# EAGLE design OmniRotor (EAGLE 6.3)
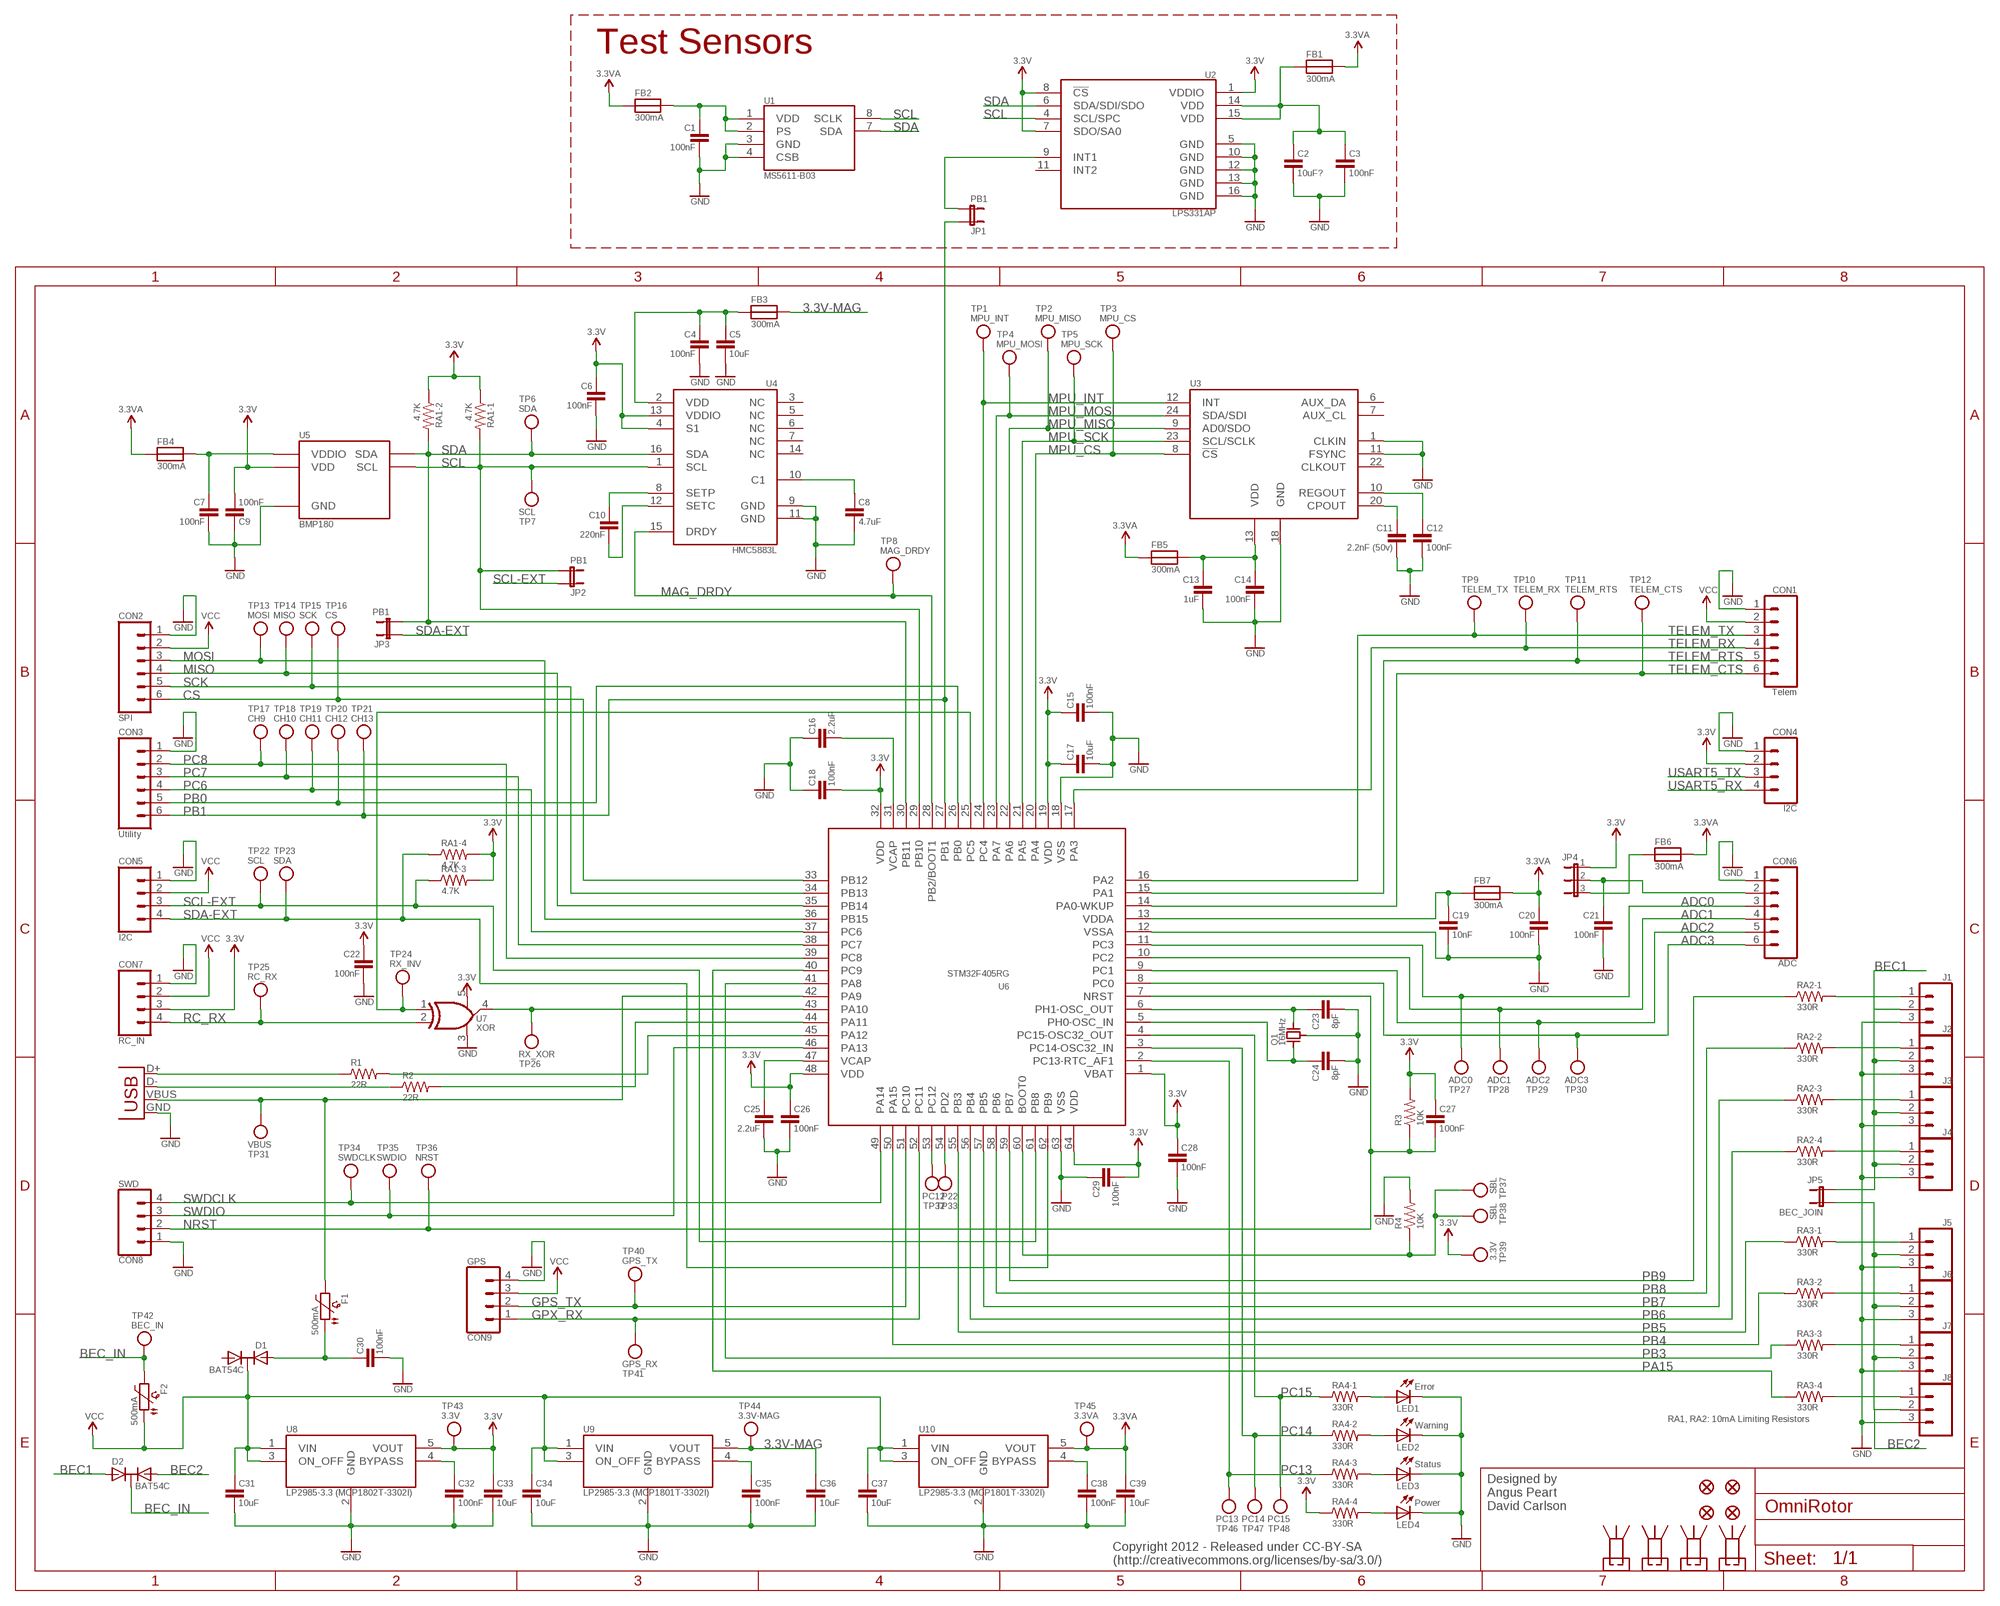
[diagram p0: schematic, sheet 1]

## Parts
C1  100nF  CAPACITOR0402  [0402-CAP@1]
C2  10uF?  CAPACITOR0603  [0603@1]
C3  100nF  CAPACITOR0402  [0402-CAP@1]
C4  100nF  CAPACITOR0402  [0402-CAP@1]
C5  10uF  CAPACITOR0805  [0805@1]
C6  100nF  CAPACITOR0402  [0402-CAP@1]
C7  100nF  CAPACITOR0402  [0402-CAP@1]
C8  4.7uF  CAPACITOR0603  [0603@1]
C9  100nF  CAPACITOR0402  [0402-CAP@1]
C10  220nF  CAPACITOR0402  [0402-CAP@1]
C11  2.2nF (50v)  CAPACITOR0402  [0402-CAP@1]
C12  100nF  CAPACITOR0402  [0402-CAP@1]
C13  1uF  CAPACITOR0603  [0603@1]
C14  100nF  CAPACITOR0402  [0402-CAP@1]
C15  100nF  CAPACITOR0402  [0402-CAP@1]
C16  2.2uF  CAPACITOR0603  [0603@1]
C17  10uF  CAPACITOR-CERAMIC0805  [0805]
C18  100nF  CAPACITOR0402  [0402-CAP@1]
C19  10nF  CAPACITOR0402  [0402-CAP@1]
C20  100nF  CAPACITOR0402  [0402-CAP@1]
C21  100nF  CAPACITOR0402  [0402-CAP@1]
C22  100nF  CAPACITOR0402  [0402-CAP@1]
C23  8pF  CAPACITOR0402  [0402-CAP@1]
C24  8pF  CAPACITOR0402  [0402-CAP@1]
C25  2.2uF  CAPACITOR0603  [0603@1]
C26  100nF  CAPACITOR0402  [0402-CAP@1]
C27  100nF  CAPACITOR0402  [0402-CAP@1]
C28  100nF  CAPACITOR0402  [0402-CAP@1]
C29  100nF  CAPACITOR0402  [0402-CAP@1]
C30  100nF  CAPACITOR0402  [0402-CAP@1]
C31  10uF  CAPACITOR-CERAMIC0805  [0805]
C32  100nF  CAPACITOR0402  [0402-CAP@1]
C33  10uF  CAPACITOR-CERAMIC0805  [0805]
C34  10uF  CAPACITOR-CERAMIC0805  [0805]
C35  100nF  CAPACITOR0402  [0402-CAP@1]
C36  10uF  CAPACITOR-CERAMIC0805  [0805]
C37  10uF  CAPACITOR-CERAMIC0805  [0805]
C38  100nF  CAPACITOR0402  [0402-CAP@1]
C39  10uF  CAPACITOR-CERAMIC0805  [0805]
CON1  Telem  M06JST-SH-SIDE  [SM06B-SRSS-TB]
CON2  SPI  M06JST-SH-SIDE  [SM06B-SRSS-TB]
CON3  Utility  M06JST-SH-SIDE  [SM06B-SRSS-TB]
CON4  I2C  M04JST-SH-SIDE  [SM04B-SRSS-TB]
CON5  I2C  M04JST-SH-SIDE  [SM04B-SRSS-TB]
CON6  ADC  M06JST-SH-SIDE  [SM06B-SRSS-TB]
CON7  RC_IN  M04JST-SH-SIDE  [SM04B-SRSS-TB]
CON8  SWD  M04JST-SH-TOP  [BM04B-SRSS-TB]
CON9  GPS  M04JST-SH-SIDE  [SM04B-SRSS-TB]
D1  BAT54C  [SOT23]
D2  BAT54C  [SOT23]
F1  500mA  PTC1210  [1210-PTC]
F2  500mA  PTC1210  [1210-PTC]
FB1  300mA  FERRITE0603  [0603]
FB2  300mA  FERRITE0603  [0603]
FB3  300mA  FERRITE0603  [0603]
FB4  300mA  FERRITE0603  [0603]
FB5  300mA  FERRITE0603  [0603]
FB6  300mA  FERRITE0603  [0603]
FB7  300mA  FERRITE0603  [0603]
FID1  FIDUCIAL1X2.5  [FIDUCIAL-1X2.5]
FID2  FIDUCIAL1X2.5  [FIDUCIAL-1X2.5]
FID3  FIDUCIAL1X2.5  [FIDUCIAL-1X2.5]
FID4  FIDUCIAL1X2.5  [FIDUCIAL-1X2.5]
J1  M03PTH  [1X03]
J2  M03PTH  [1X03]
J3  M03PTH  [1X03]
J4  M03PTH  [1X03]
J5  M03PTH  [1X03]
J6  M03PTH  [1X03]
J7  M03PTH  [1X03]
J8  M03PTH  [1X03]
JP1  PB1  JUMPER-2NO  [SJ_2_NO]
JP2  PB1  JUMPER-2NO  [SJ_2_NO]
JP3  PB1  JUMPER-2NO  [SJ_2_NO]
JP4  JUMPER-31-2  [SJ_3_PASTE1&2]
JP5  BEC_JOIN  JUMPER-2NO  [SJ_2_NO]
LED1  Error  LED0603  [0603_LED]
LED2  Warning  LED0603  [0603_LED]
LED3  Status  LED0603  [0603_LED]
LED4  Power  LED0603  [0603_LED]
LP1  LIGHTPIPE  [VLP-LIGHTPIPES]
LP2  LIGHTPIPE  [VLP-LIGHTPIPES]
LP3  LIGHTPIPE  [VLP-LIGHTPIPES]
LP4  LIGHTPIPE  [VLP-LIGHTPIPES]
Q1  16MHz  CRYSTAL-GND  [CRYSTAL_3-2X2-5]
R1  22R  RESISTOR0402  [0402-RES]
R2  22R  RESISTOR0402  [0402-RES]
R3  10K  RESISTOR0402  [0402-RES]
R4  10K  RESISTOR0402  [0402-RES]
RA1  4.7K  RESISTOR-ARRAY-1206  [1206-ARRAY]
RA2  330R  RESISTOR-ARRAY-1206  [1206-ARRAY]
RA3  330R  RESISTOR-ARRAY-1206  [1206-ARRAY]
RA4  330R  RESISTOR-ARRAY-1206  [1206-ARRAY]
TP1  MPU_INT  TESTPOINTROUND0.7MM  [TESTPOINT_ROUND_0.7MM]
TP2  MPU_MISO  TESTPOINTROUND0.7MM  [TESTPOINT_ROUND_0.7MM]
TP3  MPU_CS  TESTPOINTROUND0.7MM  [TESTPOINT_ROUND_0.7MM]
TP4  MPU_MOSI  TESTPOINTROUND0.7MM  [TESTPOINT_ROUND_0.7MM]
TP5  MPU_SCK  TESTPOINTROUND0.7MM  [TESTPOINT_ROUND_0.7MM]
TP6  SDA  TESTPOINTROUND0.7MM  [TESTPOINT_ROUND_0.7MM]
TP7  SCL  TESTPOINTROUND0.7MM  [TESTPOINT_ROUND_0.7MM]
TP8  MAG_DRDY  TESTPOINTROUND0.7MM  [TESTPOINT_ROUND_0.7MM]
TP9  TELEM_TX  TESTPOINTROUND0.7MM  [TESTPOINT_ROUND_0.7MM]
TP10  TELEM_RX  TESTPOINTROUND0.7MM  [TESTPOINT_ROUND_0.7MM]
TP11  TELEM_RTS  TESTPOINTROUND0.7MM  [TESTPOINT_ROUND_0.7MM]
TP12  TELEM_CTS  TESTPOINTROUND0.7MM  [TESTPOINT_ROUND_0.7MM]
TP13  MOSI  TESTPOINTROUND0.7MM  [TESTPOINT_ROUND_0.7MM]
TP14  MISO  TESTPOINTROUND0.7MM  [TESTPOINT_ROUND_0.7MM]
TP15  SCK  TESTPOINTROUND0.7MM  [TESTPOINT_ROUND_0.7MM]
TP16  CS  TESTPOINTROUND0.7MM  [TESTPOINT_ROUND_0.7MM]
TP17  CH9  TESTPOINTROUND0.7MM  [TESTPOINT_ROUND_0.7MM]
TP18  CH10  TESTPOINTROUND0.7MM  [TESTPOINT_ROUND_0.7MM]
TP19  CH11  TESTPOINTROUND0.7MM  [TESTPOINT_ROUND_0.7MM]
TP20  CH12  TESTPOINTROUND0.7MM  [TESTPOINT_ROUND_0.7MM]
TP21  CH13  TESTPOINTROUND0.7MM  [TESTPOINT_ROUND_0.7MM]
TP22  SCL  TESTPOINTROUND0.7MM  [TESTPOINT_ROUND_0.7MM]
TP23  SDA  TESTPOINTROUND0.7MM  [TESTPOINT_ROUND_0.7MM]
TP24  RX_INV  TESTPOINTROUND0.7MM  [TESTPOINT_ROUND_0.7MM]
TP25  RC_RX  TESTPOINTROUND0.7MM  [TESTPOINT_ROUND_0.7MM]
TP26  RX_XOR  TESTPOINTROUND0.7MM  [TESTPOINT_ROUND_0.7MM]
TP27  ADC0  TESTPOINTROUND0.7MM  [TESTPOINT_ROUND_0.7MM]
TP28  ADC1  TESTPOINTROUND0.7MM  [TESTPOINT_ROUND_0.7MM]
TP29  ADC2  TESTPOINTROUND0.7MM  [TESTPOINT_ROUND_0.7MM]
TP30  ADC3  TESTPOINTROUND0.7MM  [TESTPOINT_ROUND_0.7MM]
TP31  VBUS  TESTPOINTROUND0.7MM  [TESTPOINT_ROUND_0.7MM]
TP32  PC12  TESTPOINTROUND0.7MM  [TESTPOINT_ROUND_0.7MM]
TP33  P22  TESTPOINTROUND0.7MM  [TESTPOINT_ROUND_0.7MM]
TP34  SWDCLK  TESTPOINTROUND0.7MM  [TESTPOINT_ROUND_0.7MM]
TP35  SWDIO  TESTPOINTROUND0.7MM  [TESTPOINT_ROUND_0.7MM]
TP36  NRST  TESTPOINTROUND0.7MM  [TESTPOINT_ROUND_0.7MM]
TP37  SBL  TESTPOINTROUND1MM  [TESTPOINT_ROUND_1MM]
TP38  SBL  TESTPOINTROUND1.5MM  [TESTPOINT_ROUND_1.5MM]
TP39  3.3V  TESTPOINTROUND1.5MM  [TESTPOINT_ROUND_1.5MM]
TP40  GPS_TX  TESTPOINTROUND0.7MM  [TESTPOINT_ROUND_0.7MM]
TP41  GPS_RX  TESTPOINTROUND0.7MM  [TESTPOINT_ROUND_0.7MM]
TP42  BEC_IN  TESTPOINTROUND0.7MM  [TESTPOINT_ROUND_0.7MM]
TP43  3.3V  TESTPOINTROUND0.7MM  [TESTPOINT_ROUND_0.7MM]
TP44  3.3V-MAG  TESTPOINTROUND0.7MM  [TESTPOINT_ROUND_0.7MM]
TP45  3.3VA  TESTPOINTROUND0.7MM  [TESTPOINT_ROUND_0.7MM]
TP46  PC13  TESTPOINTROUND0.7MM  [TESTPOINT_ROUND_0.7MM]
TP47  PC14  TESTPOINTROUND0.7MM  [TESTPOINT_ROUND_0.7MM]
TP48  PC15  TESTPOINTROUND0.7MM  [TESTPOINT_ROUND_0.7MM]
U1  MS5611-B03  MS5611  [MS5611]
U2  LPS331AP  [HCLGA-16L]
U3  MPU6000  [QFN-24]
U4  HMC5883L  [16LPCC]
U5  BMP180  [BMP180]
U6  STM32F405RG  STM32FX05R  [LQFP64]
U7  XOR  74LVC1G86SC70  [SC-70-5]
U8  LP2985-3.3 (MCP1802T-3302I)  LP2985  [SOT-23-5]
U9  LP2985-3.3 (MCP1801T-3302I)  LP2985  [SOT-23-5]
U10  LP2985-3.3 (MCP1801T-3302I)  LP2985  [SOT-23-5]
USB1  USB-MICRO-B  USBMICRO-B  [USB-MICRO-B]

## Nets
3.3V: C6.1 C9.2 C15.1 C17.1 C18.2 C22.1 C26.1 C27.1 C28.1 C29.2 C33.1 CON4.2 CON7.3 JP4.1 R3.2 RA1.A1 RA1.B1 RA1.C2 RA1.D2 RA4.D1 TP39.1 TP43.1 U2.1(VDDIO) U2.7(SDO/SA0) U2.8(!CS) U4.4(S1) U4.13(VDDIO) U5.2(VDD) U6.1(VBAT) U6.19(VDD) U6.32(VDD) U6.48(VDD) U6.64(VDD) U7.5(VCC) U8.5(VOUT)
3.3V-MAG: C36.1 FB3.2 TP44.1 U9.5(VOUT)
3.3VA: C20.1 C39.1 FB1.2 FB2.1 FB4.1 FB5.1 FB6.2 FB7.2 TP45.1 U10.5(VOUT)
ADC0: CON6.3 TP27.1 U6.11(PC3)
ADC1: CON6.4 TP28.1 U6.10(PC2)
ADC2: CON6.5 TP29.1 U6.9(PC1)
ADC3: CON6.6 TP30.1 U6.8(PC0)
BEC1: D2.1 J1.2 J2.2 J3.2 J4.2 JP5.1
BEC2: D2.2 J5.2 J6.2 J7.2 J8.2 JP5.2
BEC_IN: D2.3 F2.1 TP42.1
CS: CON2.6 TP16.1 U6.33(PB12)
GND: C1.2 C2.2 C3.2 C4.2 C5.2 C6.2 C7.2 C8.2 C9.1 C11.2 C12.2 C13.2 C14.2 C15.2 C16.1 C17.2 C18.1 C19.2 C20.2 C21.2 C22.2 C23.2 C24.2 C25.2 C26.2 C28.2 C29.1 C30.2 C31.2 C32.2 C33.2 C34.2 C35.2 C36.2 C37.2 C38.2 C39.2 CON1.1 CON2.1 CON3.1 CON4.1 CON5.1 CON6.1 CON7.1 CON8.1 CON9.4 J1.3 J2.3 J3.3 J4.3 J5.3 J6.3 J7.3 J8.3 LED1.2(C) LED2.2(C) LED3.2(C) LED4.2(C) Q1.2(GND) Q1.4(GND) R4.2 U1.3(GND) U1.4(CSB) U2.5(GND) U2.10(GND) U2.12(GND) U2.13(GND) U2.16(GND) U3.1(CLKIN) U3.11(FSYNC) U3.18(GND) U4.9(GND) U4.11(GND) U5.7(GND) U6.12(VSSA) U6.18(VSS) U6.63(VSS) U7.3(GND) U8.2(GND) U9.2(GND) U10.2(GND) USB1.GND
GPS_TX: CON9.2 TP40.1 U6.51(PC10)
GPX_RX: CON9.1 TP41.1 U6.52(PC11)
MAG_DRDY: TP8.1 U4.15(DRDY) U6.28(PB2/BOOT1)
MISO: CON2.4 TP14.1 U6.35(PB14)
MOSI: CON2.3 TP13.1 U6.36(PB15)
MPU_CS: TP3.1 U3.8(!CS!) U6.20(PA4)
MPU_INT: TP1.1 U3.12(INT) U6.24(PC4)
MPU_MISO: TP2.1 U3.9(AD0/SDO) U6.22(PA6)
MPU_MOSI: TP4.1 U3.24(SDA/SDI) U6.23(PA7)
MPU_SCK: TP5.1 U3.23(SCL/SCLK) U6.21(PA5)
N$1: C19.1 FB7.1 U6.13(VDDA)
N$2: C23.1 Q1.3 U6.6(PH1-OSC_OUT)
N$3: C24.1 Q1.1 U6.5(PH0-OSC_IN)
N$4: C30.1 D1.1 F1.2
N$5: C32.1 U8.4(BYPASS)
N$6: TP24.1 U6.25(PC5) U7.1(I0)
N$7: C35.1 U9.4(BYPASS)
N$8: R1.1 USB1.D+
N$9: R2.1 USB1.D-
N$10: R2.2 U6.44(PA11)
N$11: R1.2 U6.45(PA12)
N$13: TP26.1 U6.43(PA10) U7.4(O)
N$15: C10.1 U4.8(SETP)
N$16: C10.2 U4.12(SETC)
N$18: C13.1 C14.1 FB5.2 U3.13(VDD)
N$20: C8.1 U4.10(C1)
N$21: C21.1 CON6.2 JP4.2
N$23: C2.1 C3.1 FB1.1 U2.14(VDD) U2.15(VDD)
N$24: LED4.1(A) RA4.D2
N$26: LED3.1(A) RA4.C2
N$29: FB6.1 JP4.3
N$30: LED2.1(A) RA4.B2
N$31: C11.1 U3.20(CPOUT)
N$32: C12.1 U3.10(REGOUT)
N$33: LED1.1(A) RA4.A2
N$34: J2.1 RA2.B2
N$35: J3.1 RA2.C2
N$36: J4.1 RA2.D2
N$37: J1.1 RA2.A2
N$38: J6.1 RA3.B2
N$39: J7.1 RA3.C2
N$40: J8.1 RA3.D2
N$41: J5.1 RA3.A2
N$44: JP1.2 U2.9(INT1)
N$46: R4.1 TP37.1 TP38.1 U6.60(BOOT0)
N$51: C38.1 U10.4(BYPASS)
N$54: C4.1 C5.1 FB3.1 U4.2(VDD)
N$58: C7.1 FB4.2 U5.3(VDDIO)
N$64: C1.1 FB2.2 U1.1(VDD) U1.2(PS)
NRST: C27.2 CON8.2 R3.1 TP36.1 U6.7(NRST)
PA15: RA3.D1 U6.40(PC9)
PB0: CON3.5 TP20.1 U6.26(PB0)
PB1: CON3.6 JP1.1 TP21.1 U6.27(PB1)
PB3: RA3.C1 U6.41(PA8)
PB4: RA3.B1 U6.50(PA15)
PB5: RA3.A1 U6.55(PB3)
PB6: RA2.D1 U6.56(PB4)
PB7: RA2.C1 U6.57(PB5)
PB8: RA2.B1 U6.58(PB6)
PB9: RA2.A1 U6.59(PB7)
PC6: CON3.4 TP19.1 U6.37(PC6)
PC7: CON3.3 TP18.1 U6.38(PC7)
PC8: CON3.2 TP17.1 U6.39(PC8)
PC13: RA4.C1 TP46.1 U6.2(PC13-RTC_AF1)
PC14: RA4.B1 TP47.1 U6.3(PC14-OSC32_IN)
PC15: RA4.A1 TP48.1 U6.4(PC15-OSC32_OUT)
RC_RX: CON7.4 TP25.1 U7.2(I1)
SCK: CON2.5 TP15.1 U6.34(PB13)
SCL: JP2.2 RA1.A2 TP7.1 U1.8(SCLK) U2.4(SCL/SPC) U4.1(SCL) U5.5(SCL) U6.29(PB10)
SCL-EXT: CON5.3 JP2.1 RA1.C1 TP22.1 U6.61(PB8)
SDA: JP3.2 RA1.B2 TP6.1 U1.7(SDA) U2.6(SDA/SDI/SDO) U4.16(SDA) U5.6(SDA) U6.30(PB11)
SDA-EXT: CON5.4 JP3.1 RA1.D1 TP23.1 U6.62(PB9)
SWDCLK: CON8.4 TP34.1 U6.49(PA14)
SWDIO: CON8.3 TP35.1 U6.46(PA13)
TELEM_CTS: CON1.6 TP12.1 U6.14(PA0-WKUP)
TELEM_RTS: CON1.5 TP11.1 U6.15(PA1)
TELEM_RX: CON1.4 TP10.1 U6.17(PA3)
TELEM_TX: CON1.3 TP9.1 U6.16(PA2)
USART5_RX: CON4.4 TP33.1 U6.54(PD2)
USART5_TX: CON4.3 TP32.1 U6.53(PC12)
VCAP@1: C16.2 U6.31(VCAP)
VCAP@2: C25.1 U6.47(VCAP)
VCC: C31.1 C34.1 C37.1 CON1.2 CON2.2 CON5.2 CON7.2 CON9.3 D1.3 F2.2 U8.1(VIN) U8.3(ON_OFF) U9.1(VIN) U9.3(ON_OFF) U10.1(VIN) U10.3(ON_OFF)
VUSB: F1.1 TP31.1 U6.42(PA9) USB1.VBUS
Unconnected: D1.2 U2.11(INT2) U3.6(AUX_DA) U3.7(AUX_CL) U3.22(CLKOUT) U4.3(NC) U4.5(NC) U4.6(NC) U4.7(NC) U4.14(NC)

## Notes on the sheet
- Test Sensors
- RA1, RA2: 10mA Limiting Resistors
- Designed by
  Angus Peart
  David Carlson
- Copyright 2012 - Released under CC-BY-SA
  (http://creativecommons.org/licenses/by-sa/3.0/)

## Library data of the parts
C1-C16 C18-C30 C32 C35 C38 = OmniLoco:CAPACITOR: Capacitor Standard SMD ceramic capacitors.
C17 C31 C33 C34 C36 C37 C39 = OmniLoco:CAPACITOR-CERAMIC: Ceramic Capacitors 0402 - 0402 Surface Mount Capacitors 18pF 50V 5% [Digikey: 587-1950-1-ND] 10nF 6.3V 10% [Digikey: 311-1349-1-ND] 0.1uF 10V 10% [Digikey: 587-1227-1-ND] 0.1uF 16V 10% [Digikey: 587-1451-1-ND] 0.22uF 6.3V 10% [Digikey: 587-1229-1-ND] 0603 - 0603 Surface Mount Capacitors 2.2uF 6.3V 10% [Digikey: 587-1254-1-ND] 2.2uF 10V 10% [Digikey: 587-1253-1-ND] 4.7uF 6.3V 10% [Digikey: 587-1785-1-ND] 0805 - 0805 Surface Mount Capacitors 10uF 16V 10% [Digikey: 587-1295-1-ND]
CON1-CON3 CON6 = OmniLoco:M06: Six Way Connector JST SH/SR Vertical Connector - BM06B-SRSS-TB(LF)(SN) [Digikey: 455-1792-1-ND] JST SH/SR Right-Angle Connector - SM06B-SRSS-TB(LF)(SN) [Digikey: 455-1806-1-ND] JST-SH-TOP - Vertical JST-SH footprint. JST-SH-SIDE - Right-angle JST-SH footprint.
CON4 CON5 CON7-CON9 = OmniLoco:M04: Four Way Connector JST SH/SR Vertical Connector - BM04B-SRSS-TB(LF)(SN)(P) [Digikey: 455-1790-1-ND] JST SH/SR Right-Angle Connector - SM04B-SRSS-TB(LF)(SN)(P) [Digikey: 455-1804-1-ND] JST-SH-TOP - Vertical JST-SH footprint. JST-SH-SIDE - Right-angle JST-SH footprint.
D1 D2 = OmniLoco:BAT54C: BAT54C Schottky Diodes (Common Cathode) Vf: 800mV, 30V 200mA - BAT543C [Digikey: BAT54CFSCT-ND] Vf: 900mV, 40V 300mA - BAT54CFILM [Digikey: 497-3786-2-ND]
F1 F2 = OmniLoco:PTC: PTC (Resettable Fuse) 1206 Package 400mA (Trip) PTC (30V Max, Time-to-Trip: 0.05s) - Digikey: 507-1478-1-ND 1210 Package 400mA (Trip) PTC (30V Max, Time-to-Trip: 0.02s) - Digikey: 507-1487-1-ND 1812 Package 200mA PTC (Trip) (30V Max, Time-to-Trip: 0.02s) - Digikey: 507-1496-1-ND 750mA PTC (Trip) (24V Max, Time-to-Trip: 0.2s) - Digikey: MF-MSMF075/24-2CT-ND
FB1-FB7 = OmniLoco:FERRITE: Ferrite Bead 0603 HZ0603B102R-10 - 1K Ohm, 200mA [Digikey: 240-2378-1-ND] 742792664 - 1K Ohm, 300mA [Digikey: 732-1586-1-ND]
FID1-FID4 = OmniLoco:FIDUCIAL: Fiducial Alignment Points Various fiducial points for machine vision alignment.
J1-J8 = OmniLoco:M03: Three Way Connector PTH - Standard 0.1" through-hole footprint.
JP1-JP3 JP5 = OmniLoco:JUMPER-2: Two Way Jumpers
JP4 = OmniLoco:JUMPER-3: Three Way Jumpers
LED1-LED4 = OmniLoco:LED: LED - Light Emmiting Diodes LED 0603 (20mA 220mCd Vf1.95) Red - APT1608SURCK [Digikey: 754-1123-1-ND] LED 0603 (20mA 240mCd Vf=2.1) Orange - APT1608SECK [Digikey: 754-1120-1-ND] LED 0603 (20mA 100mCd Vf=3.3) Blue - APT1608QBC/D [Digikey: 754-1434-1-ND] LED 0603 (20mA 50mCd Vf=2.1) Green - APT1608CGCK [Digikey: 754-1116-1-ND] Light Pipes 0.400" (10.16mm) High Round Lightpipe - VLP-400-R [Digikey: VLP-400-R-ND] 0.350" (8.89mm) High Round Lightpipe - VLP-350-F [Digikey: 492-1309-ND] 0603 - Standard 0603 footprint with LED silkscreen markings. 0603-LP - Standard 0603 footprint with mounting holes and clearances for VLP-XXX series lightpipes. 1206 - Standard 1206 footprint.
LP1-LP4 = OmniLoco:LIGHTPIPE: Light Pipes 0.400" (10.16mm) High Round Lightpipe - VLP-400-R [Digikey: VLP-400-R-ND] 0.350" (8.89mm) High Round Lightpipe - VLP-350-F [Digikey: 492-1309-ND]
Q1 = OmniLoco:CRYSTAL-GND: Crystals (with grounding) 3.2x2.5MM 4SMD - Surface Mount Crystal 16.0MHz 8pF +/-10ppm [Digikey: 887-1319-1-ND]
R1-R4 = OmniLoco:RESISTOR: Resistors 0402 - 0402 Surface Mount Resistors 22 Ohm 1/16W 5% [Digikey: 311-22JRCT-ND] 4.7K Ohm 1/16W 5% [Digikey: 311-4.7KJRCT-ND] 10K Ohm 1/16W 5% [Digikey: 311-10KJRCT-ND]
RA1-RA4 = OmniLoco:RESISTOR-ARRAY: Resistor Arrays 1206 (Concave) - 1206 (Concave) Surface Mount Resistor Arrays 330 Ohm 1/16W 5% [Digikey: TC164J-330CT-ND]
TP1-TP48 = OmniLoco:TESTPOINT: Testpoint Footprints for testpoints, commonly used for debugging or connection points for pogopins. POGOPIN1MM - Throughhole footprint for 1mm pogopins. ROUND0.5MM - Small testpoint for use with 0.48mm diameter pogopins. ROUND0.7MM - Small testpoint for use with 0.68mm diameter pogopins. ROUND1MM - Small testpoint for use with 1.02mm diameter pogopins. ROUND1.5MM - Larger testpoint more suited to handheld probing.
U1 = OmniLoco:MS5611: MS5611 - Measurement Specialties Pressure Sensor Pressure Sensor (Plastic Case) - MS5611-01BA01 [Meas-Spec: MS5611-01BA01] Pressure Sensor (Metal Case) - MS5611-01BA03 [Meas-Spec: MS5611-01BA03]
U2 = OmniLoco:LPS331AP: LPS331AP - MEMS Pressure Sensor LPS331AP [Digikey: 497-12927-1-ND]
U3 = OmniLoco:MPU6000: MPU6000 - Six-Axis (Gyro + Accelerometer) MEMS MotionTracking™ Device 3 Axis Digital Gyroscope and Accelerometer - MPU6000 [Invensense: MPU-6000]
U4 = OmniLoco:HMC5883L: HMC5883L - Honeywell Magnetic Sensor 3 Axis Digital Compass IC - HMC5883L [Digikey: 342-1082-1-ND]
U5 = OmniLoco:BMP180: BMP180 - Bosch Sensortec Pressure Sensor Barometric Pressure Sensor - BMP180 [Digikey: 828-1027-1-ND]
U6 = OmniLoco:STM32FX05R: STM32Fx05R - STM32 F2 and F4 Microcontroller F2 Series 128KB Flash - STM32F205RBT6 [Digikey: 497-11153-ND] 256KB Flash - STM32F205RCT6 [Digikey: 497-11154-ND] 512KB Flash - STM32F205RET6 [Digikey: 497-11155-ND] 768KB Flash - STM32F205RFT6 [Digikey: 497-11156-ND] 1024KB Flash - STM32F205RGT6 [Digikey: 497-11157-ND] F4 Series 1024KB Flash - STM32F405RGT6 [Digikey: 497-11767-ND]
U7 = OmniLoco:74LVC1G86: XOR Logic Gate - 7400 Series Logic Exclusive OR Gate (Inverter) SC-70-5 - SN74LVC1G86DCKR [Digikey: 296-9854-1-ND] Exclusive OR Gate (Inverter) SOT353 - 74LVC1G86SE-7 [Digikey: 74LVC1G86SE-7DICT-ND] SOT353 - Standard SOT353 package. SC70 - Smaller SC-70-5 package for high density designs.
U8-U10 = OmniLoco:LP2985: LP2985 - Low Dropout Linear Regulator 3.3V 150mA - LP2985-33DBVR [Digikey: 296-18476-1-ND]
USB1 = OmniLoco:USB: USB Connectors Micro USB - ZX62-B-5PA(11) [Digikey: H11634CT-ND] Micro USB (with posts) - 10118193-0001LF [Digikey: 609-4616-1-ND]

## Board
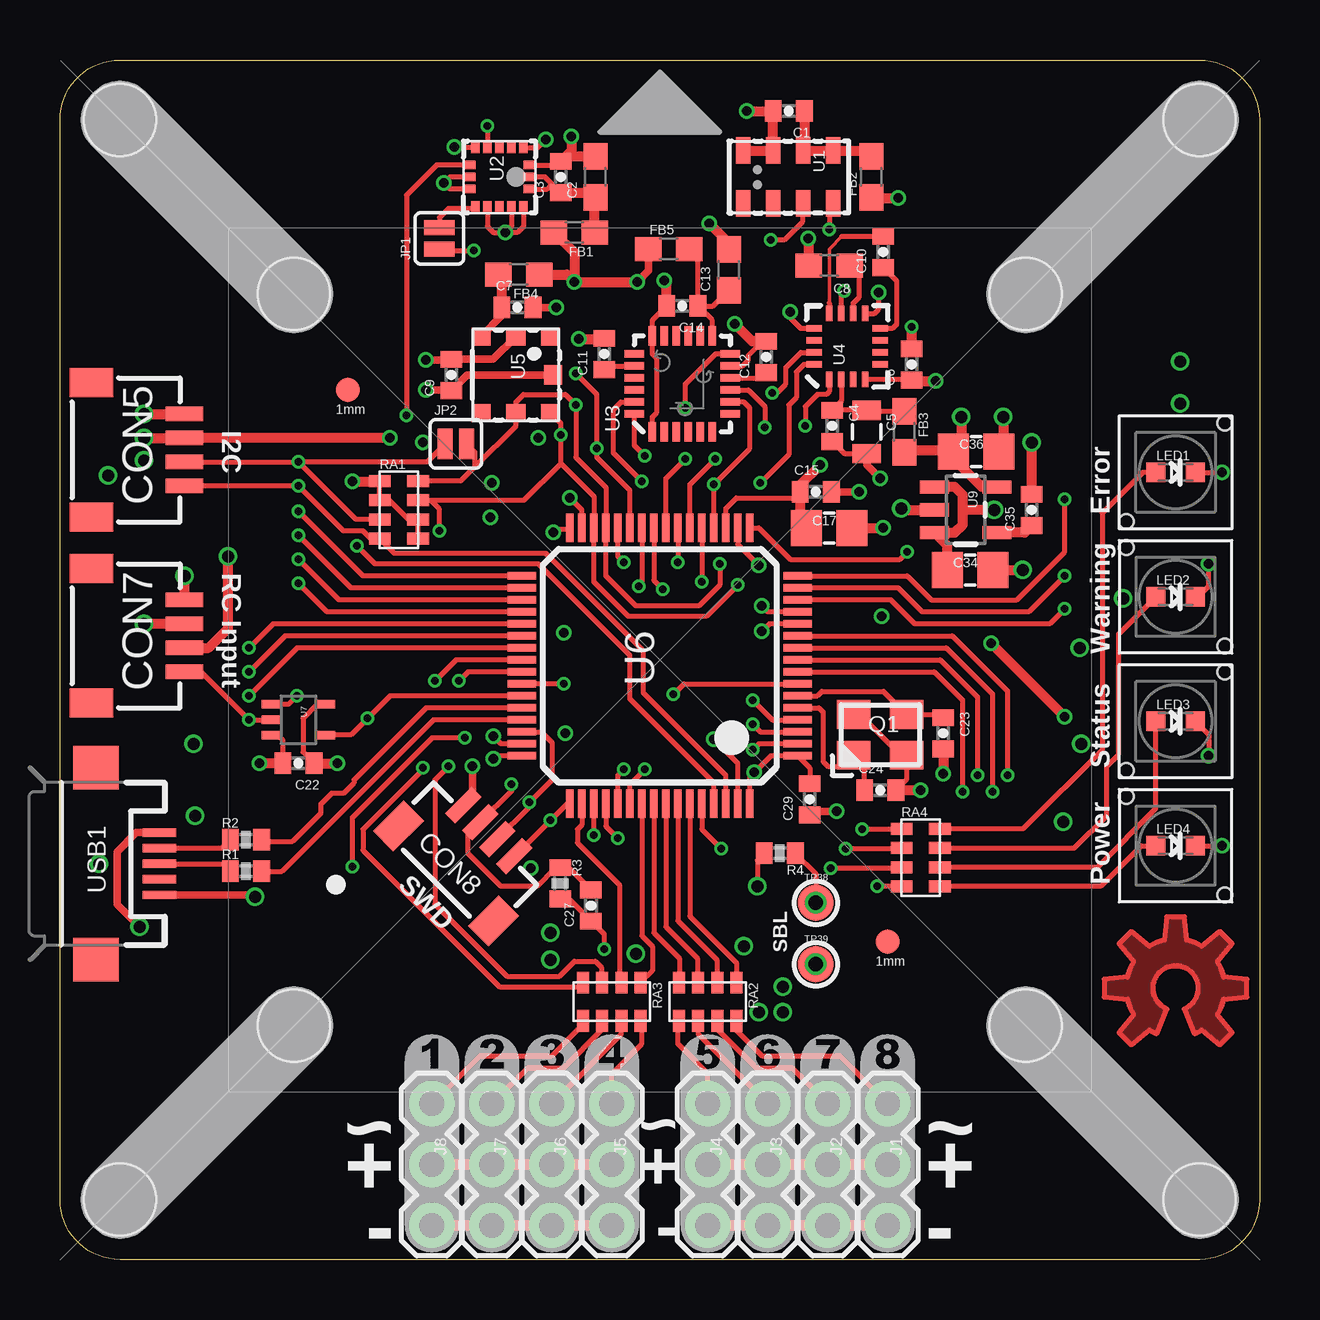
[diagram p1: board, top side]
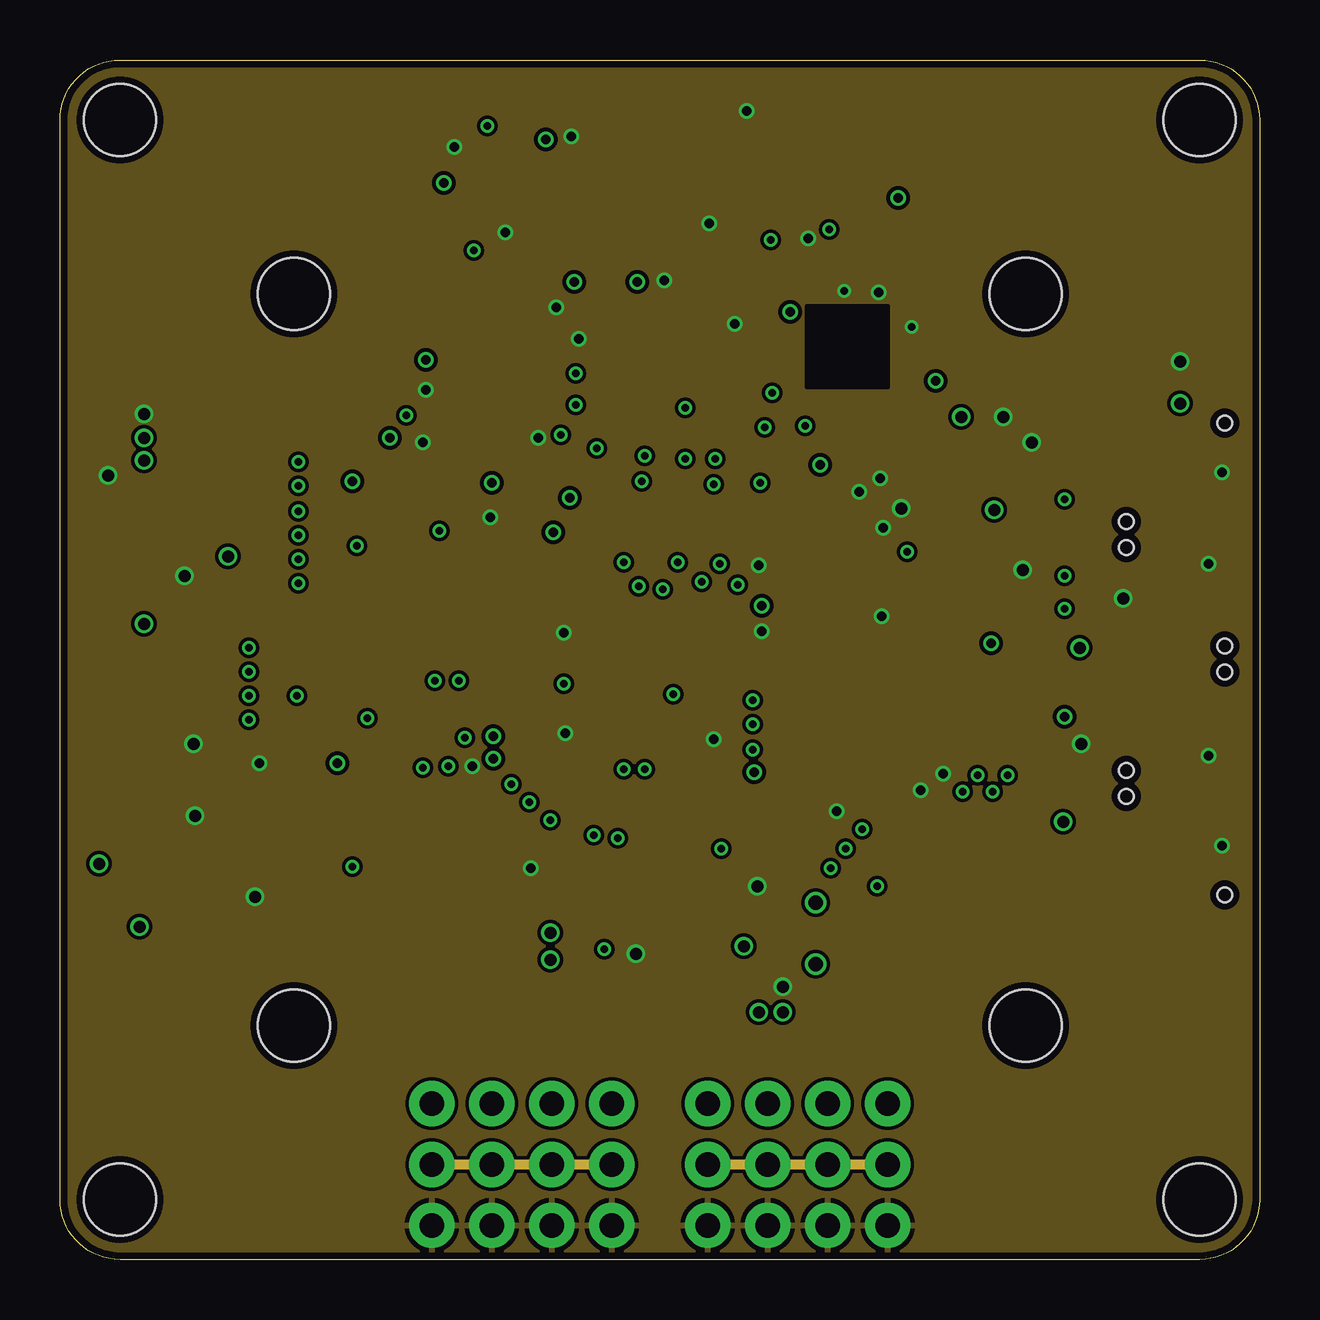
[diagram p2: board, inner layer Route2]
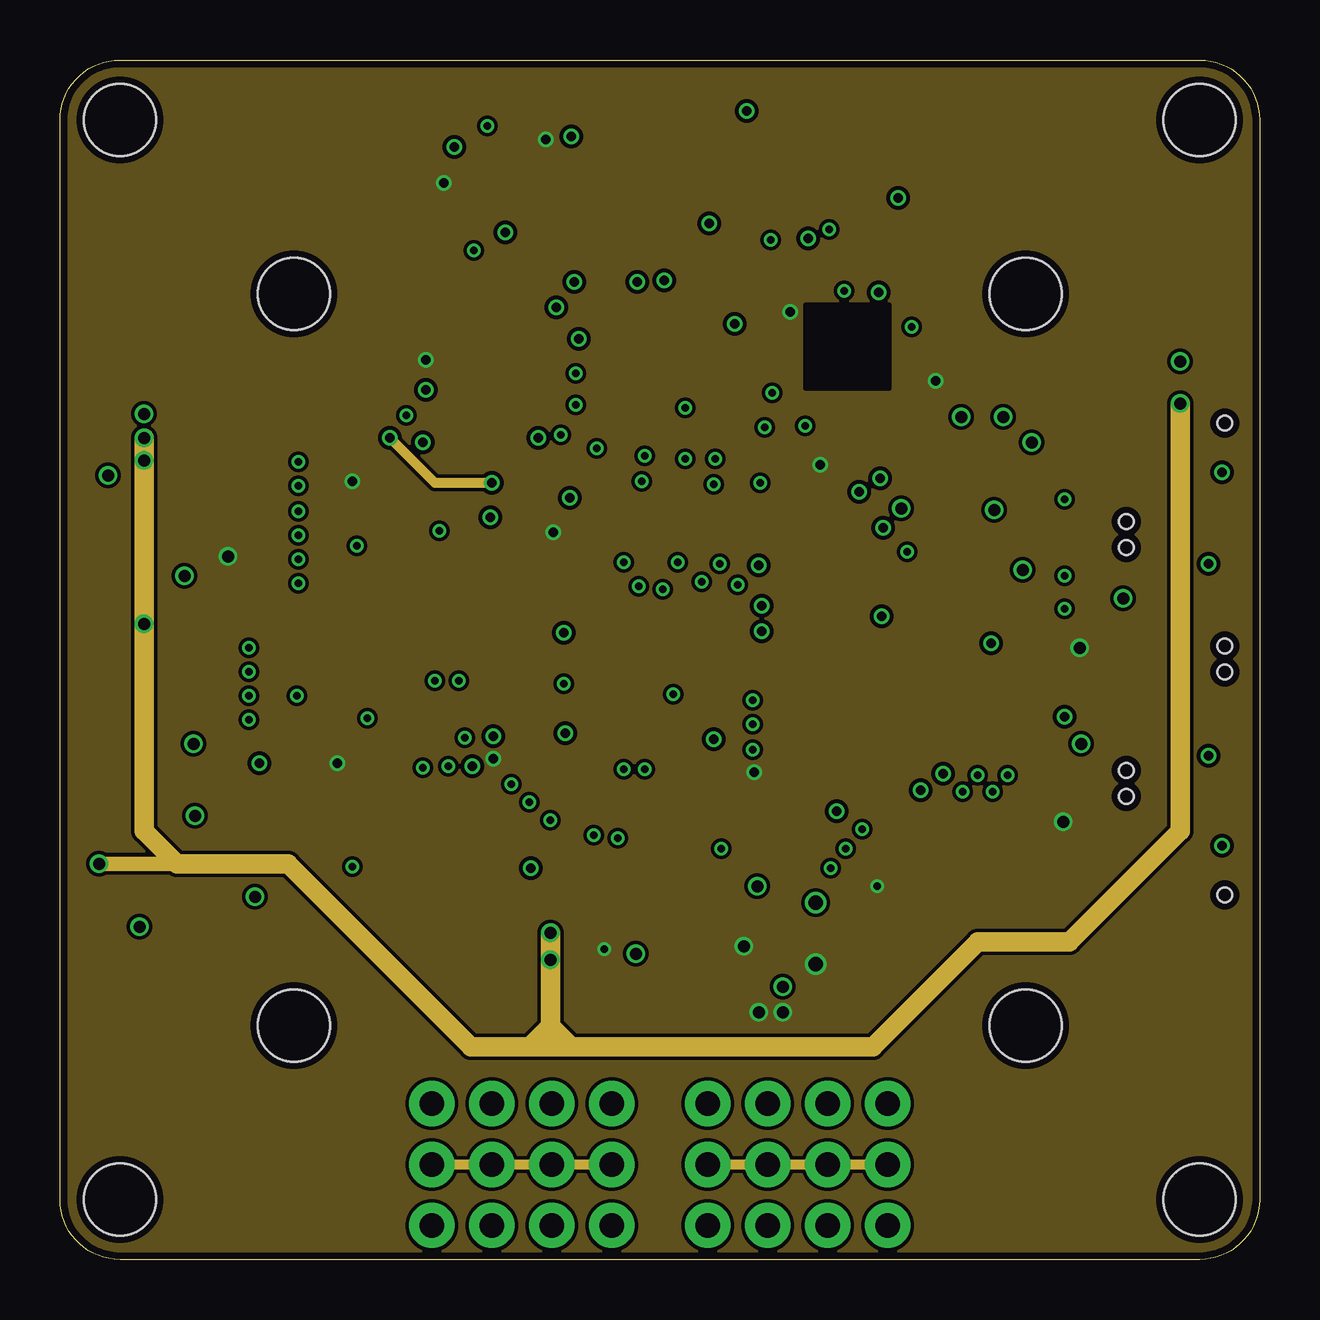
[diagram p3: board, inner layer Route15]
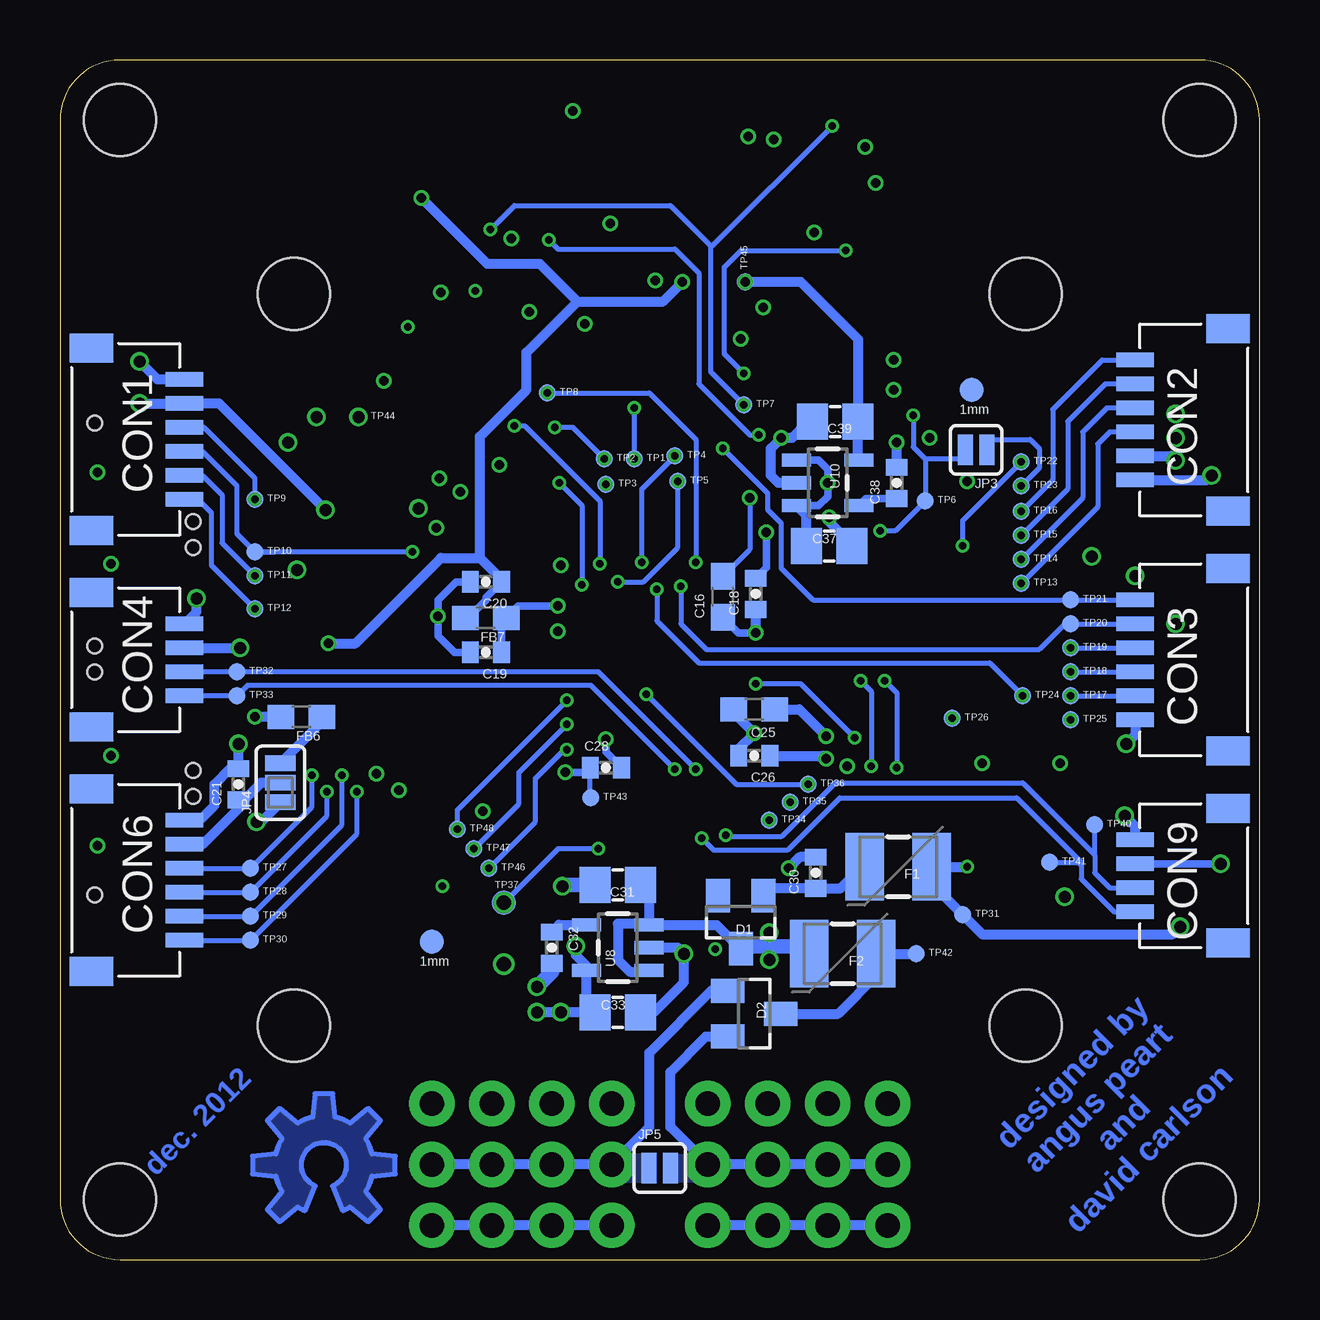
[diagram p4: board, bottom side, seen from below]

Size 50 x 50 mm. Coordinates in mm from the lower left corner, seen from the top.
Outline: 0,2.5 0,47.5 arc-90 2.5,50 47.5,50 arc-90 50,47.5 50,2.5 arc-90 47.5,0 2.5,0 arc-90 0,2.5
Copper layers (1*2+15*16): Top 0.0356mm / dielectric 1.5011mm / Route2 0.0356mm / dielectric 0.1499mm / Route15 0.0356mm / dielectric 0.2007mm / Bottom 0.0356mm
Design rules "PCBWing (4 Layer) *": minimum track width 0.15mm, minimum drill 0.3mm, track to track 0.15mm, track to pad 0.15mm, pad to pad 0.15mm, via to via 0.15mm, smd to smd 0.15mm, copper to edge 0.3mm, drill to drill 0.3mm, minimum pad ring 0.13mm, minimum via ring 0.13mm, stop-mask expansion 4mil, vias tented up to drill 25mil, thermal gap 8mil
Holes 3 mm at 9.75,40.25 40.25,40.25 40.25,9.75 9.75,9.75 2.5,47.5 47.5,47.5 47.5,2.5 2.5,2.5
tKeepout: area 0.2,0.2 to 5.2,5.2; area 7.2,7.2 to 12.2,12.2; area 0.2,44.8 to 5.2,49.8; area 7.2,37.8 to 12.2,42.8; area 37.8,37.8 to 42.8,42.8; area 37.8,7.2 to 42.8,12.2; area 44.8,0.2 to 49.8,5.2; area 44.8,44.8 to 49.8,49.8; 5 lines

### Footprints (pad centres in the part's own frame; a part is rotated, then mirrored left to right if it is on the bottom)
0402-CAP@1 = smd 0.7 x 0.9: 1 -0.65,0; 2 0.65,0
0603@1 = smd 1.1 x 1: 1 -0.85,0; 2 0.85,0
0805@1 = smd 0.8 x 1.2: 1 -0.9,0; 2 0.9,0
0805 = smd 1.3 x 1.5: 1 -0.95,0; 2 0.95,0
SM06B-SRSS-TB = smd 0.6 x 1.55: 1 0,0; 2 1,0; 3 2,0; 4 3,0; 5 4,0; 6 5,0 | smd 1.2 x 1.8: NC@1 -1.3,-3.875; NC@2 6.3,-3.875
SM04B-SRSS-TB = smd 0.6 x 1.55: 1 0,0; 2 1,0; 3 2,0; 4 3,0 | smd 1.2 x 1.8: NC@1 -1.3,-3.875; NC@2 4.3,-3.875
BM04B-SRSS-TB = smd 0.6 x 1.55: 1 0,0; 2 1,0; 3 2,0; 4 3,0 | smd 1.2 x 1.8: NC@1 -1.3,-2.525; NC@2 4.3,-2.525
SOT23 = smd 1 x 1.4: 1 -0.95,-1.1; 2 0.95,-1.1; 3 0,1.1
1210-PTC = smd 1.6 x 2.8: 1 -1.4,0; 2 1.4,0
0603 = smd 1.1 x 1: 1 -0.85,0; 2 0.85,0
FIDUCIAL-1X2.5 = smd 1 x 1: 1 0,0
1X03 = drill 1.016 pad 1.88: 1 0,0; 2 2.54,0; 3 5.08,0
SJ_2_NO = smd 0.635 x 1.27: 1 -0.445,0; 2 0.445,0
SJ_3_PASTE1&2 = smd 0.635 x 1.27: 1 -0.813,0; 2 0,0; 3 0.813,0
0603_LED = smd 0.8 x 0.8: 1 -0.825,0; 2 0.825,0
VLP-LIGHTPIPES = hole 0.61: 2.05,2.05; -2.05,-2.05
CRYSTAL_3-2X2-5 = smd 1.4 x 1.2: 1 -1.1,-0.85; 2 1.1,-0.85; 3 1.1,0.85; 4 -1.1,0.85
0402-RES = smd 0.7 x 0.9: 1 -0.65,0; 2 0.65,0
1206-ARRAY = smd 0.9 x 0.5: A1 -0.8,1.2; A2 0.8,1.2; B1 -0.8,0.4; B2 0.8,0.4; C1 -0.8,-0.4; C2 0.8,-0.4; D1 -0.8,-1.2; D2 0.8,-1.2
TESTPOINT_ROUND_0.7MM = smd 0.7 x 0.7: 1 0,0
TESTPOINT_ROUND_1MM = smd 1 x 1: 1 0,0
TESTPOINT_ROUND_1.5MM = smd 1.5 x 1.5: 1 0,0
MS5611 = smd 1.1 x 0.6: 1 -1.1,1.85; 2 -1.1,0.6; 3 -1.1,-0.65; 4 -1.1,-1.9; 5 1.1,-1.9; 6 1.1,-0.65; 7 1.1,0.6; 8 1.1,1.85
HCLGA-16L = smd 0.45 x 0.35: 1 -1.225,1; 2 -1.225,0.5; 3 -1.225,0; 4 -1.225,-0.5; 5 -1.225,-1; 9 1.225,-1; 10 1.225,-0.5; 11 1.225,0; 12 1.225,0.5; 13 1.225,1 | smd 0.35 x 0.45: 6 -0.5,-1.225; 7 0,-1.225; 8 0.5,-1.225; 14 0.5,1.225; 15 0,1.225; 16 -0.5,1.225
QFN-24 = smd 0.8 x 0.3: 1 -2,1.25; 2 -2,0.75; 3 -2,0.25; 4 -2,-0.25; 5 -2,-0.75; 6 -2,-1.25; 13 2,-1.25; 14 2,-0.75; 15 2,-0.25; 16 2,0.25; 17 2,0.75; 18 2,1.25 | smd 0.3 x 0.8: 7 -1.25,-2; 8 -0.75,-2; 9 -0.25,-2; 10 0.25,-2; 11 0.75,-2; 12 1.25,-2; 19 1.25,2; 20 0.75,2; 21 0.25,2; 22 -0.25,2; 23 -0.75,2; 24 -1.25,2
16LPCC = smd 0.65 x 0.28: 1 -1.37,0.75; 2 -1.37,0.25; 3 -1.37,-0.25; 4 -1.37,-0.75; 9 1.37,-0.75; 10 1.37,-0.25; 11 1.37,0.25; 12 1.37,0.75 | smd 0.28 x 0.65: 5 -0.75,-1.37; 6 -0.25,-1.37; 7 0.25,-1.37; 8 0.75,-1.37; 13 0.75,1.37; 14 0.25,1.37; 15 -0.25,1.37; 16 -0.75,1.37
BMP180 = smd 0.75 x 0.8: 1 -1.6,1.45; 2 -1.6,0; 3 -1.6,-1.45; 4 1.6,-1.45; 5 1.6,0; 6 1.6,1.45 | smd 0.8 x 0.75: 7 0,1.55
LQFP64 = smd 0.3 x 1.2: 1 -3.75,-5.75; 2 -3.25,-5.75; 3 -2.75,-5.75; 4 -2.25,-5.75; 5 -1.75,-5.75; 6 -1.25,-5.75; 7 -0.75,-5.75; 8 -0.25,-5.75; 9 0.25,-5.75; 10 0.75,-5.75; 11 1.25,-5.75; 12 1.75,-5.75; 13 2.25,-5.75; 14 2.75,-5.75; 15 3.25,-5.75; 16 3.75,-5.75; 33 3.75,5.75; 34 3.25,5.75; 35 2.75,5.75; 36 2.25,5.75; 37 1.75,5.75; 38 1.25,5.75; 39 0.75,5.75; 40 0.25,5.75; 41 -0.25,5.75; 42 -0.75,5.75; 43 -1.25,5.75; 44 -1.75,5.75; 45 -2.25,5.75; 46 -2.75,5.75; 47 -3.25,5.75; 48 -3.75,5.75 | smd 1.2 x 0.3: 17 5.75,-3.75; 18 5.75,-3.25; 19 5.75,-2.75; 20 5.75,-2.25; 21 5.75,-1.75; 22 5.75,-1.25; 23 5.75,-0.75; 24 5.75,-0.25; 25 5.75,0.25; 26 5.75,0.75; 27 5.75,1.25; 28 5.75,1.75; 29 5.75,2.25; 30 5.75,2.75; 31 5.75,3.25; 32 5.75,3.75; 49 -5.75,3.75; 50 -5.75,3.25; 51 -5.75,2.75; 52 -5.75,2.25; 53 -5.75,1.75; 54 -5.75,1.25; 55 -5.75,0.75; 56 -5.75,0.25; 57 -5.75,-0.25; 58 -5.75,-0.75; 59 -5.75,-1.25; 60 -5.75,-1.75; 61 -5.75,-2.25; 62 -5.75,-2.75; 63 -5.75,-3.25; 64 -5.75,-3.75
SC-70-5 = smd 0.35 x 0.85: 1 -0.65,-1.1; 2 0,-1.1; 3 0.65,-1.1; 4 0.65,1.1; 5 -0.65,1.1
SOT-23-5 = smd 0.55 x 1.2: 1 -0.95,-1.3; 2 0,-1.3; 3 0.95,-1.3; 4 0.95,1.3; 5 -0.95,1.3
USB-MICRO-B = smd 0.35 x 1.4: D+ 0,2.65; D- -0.65,2.65; GND 1.3,2.65; ID 0.65,2.65; VBUS -1.3,2.65 | smd 1.8 x 1.9: MT1 -4,0; MT2 4,0

### Placement (x,y rotation side)
C1  30.38,47.88 180 top
C2  22.31,45.12 90 top
C3  20.88,45.12 90 top
C4  32.19,34.75 270 top
C5  33.62,34.5 270 top
C6  35.5,37.31 90 top
C7  19.06,39.69 0 top
C8  32.06,41.44 180 top
C9  16.31,36.88 90 top
C10  34.31,42 90 top
C11  22.69,37.75 90 top
C12  29.44,37.62 90 top
C13  27.88,41.25 90 top
C14  25.94,39.75 180 top
C15  31.5,32 0 top
C16  22.38,27.62 90 bottom
C17  32.06,30.5 0 top
C18  21,27.75 90 bottom
C19  32.25,25.31 180 bottom
C20  32.25,28.25 180 bottom
C21  42.56,19.81 90 bottom
C22  9.94,20.69 180 top
C23  36.81,21.94 270 top
C24  34.19,19.56 0 top
C25  21.06,22.94 180 bottom
C26  21.06,21 180 bottom
C27  22.13,14.76 90 top
C28  27.25,20.5 0 bottom
C29  31.25,19.19 90 top
C30  18.5,16.12 90 bottom
C31  26.75,15.62 180 bottom
C32  29.5,13 270 bottom
C33  26.75,10.31 0 bottom
C34  37.94,28.75 0 top
C35  40.5,31.25 90 top
C36  38.19,33.69 0 top
C37  17.94,29.75 0 bottom
C38  15.12,32.38 90 bottom
C39  17.69,34.94 180 bottom
CON1  44.81,36.69 270 bottom
CON2  5.19,32.5 90 bottom
CON3  5.19,22.5 90 bottom
CON4  44.81,26.5 270 bottom
CON5  5.19,35.25 270 top
CON6  44.81,18.31 270 bottom
CON7  5.19,27.5 270 top
CON8  16.81,18.94 315 top
CON9  5.19,14.5 90 bottom
D1  21.62,14.06 180 bottom
D2  21.06,10.25 270 bottom
F1  15.06,16.38 180 bottom
F2  17.38,12.75 180 bottom
FB1  21.44,42.81 180 top
FB2  33.81,45.12 90 top
FB3  35.19,34.5 270 top
FB4  19.12,41.06 180 top
FB5  25.38,42.12 0 top
FB6  39.94,22.62 180 bottom
FB7  32.25,26.75 180 bottom
FID1  34.5,13.25 0 bottom
FID2  12,36.25 0 bottom
FID3  34.5,13.25 0 top
FID4  12,36.25 0 top
J1  34.5,6.5 270 top
J2  32,6.5 270 top
J3  29.5,6.5 270 top
J4  27,6.5 270 top
J5  23,6.5 270 top
J6  20.5,6.5 270 top
J7  18,6.5 270 top
J8  15.5,6.5 270 top
JP1  15.81,42.56 90 top
JP2  16.5,34 0 top
JP3  11.81,33.75 180 bottom
JP4  40.81,19.88 90 bottom
JP5  25,3.81 0 bottom
LED1  46.5,32.81 0 top
LED2  46.5,27.62 0 top
LED3  46.5,22.44 0 top
LED4  46.5,17.25 0 top
LP1  46.5,17.25 90 top
LP2  46.5,22.44 0 top
LP3  46.5,27.62 90 top
LP4  46.5,32.81 0 top
Q1  34.19,21.88 0 top
R1  7.75,16.19 0 top
R2  7.75,17.5 0 top
R3  20.85,15.68 270 top
R4  30,16.94 180 top
RA1  14.12,31.25 0 top
RA2  27,10.75 270 top
RA3  23,10.75 270 top
RA4  35.88,16.75 0 top
TP1  26.06,33.38 0 bottom
TP2  27.31,33.38 0 bottom
TP3  27.25,32.31 0 bottom
TP4  24.38,33.5 0 bottom
TP5  24.25,32.44 0 bottom
TP6  13.94,31.62 0 bottom
TP7  21.5,35.62 0 bottom
TP8  29.69,36.12 0 bottom
TP9  41.88,31.69 0 bottom
TP10  41.88,29.5 0 bottom
TP11  41.88,28.5 0 bottom
TP12  41.88,27.12 0 bottom
TP13  9.94,28.19 0 bottom
TP14  9.94,29.19 0 bottom
TP15  9.94,30.19 0 bottom
TP16  9.94,31.19 0 bottom
TP17  7.88,23.5 0 bottom
TP18  7.88,24.5 0 bottom
TP19  7.88,25.5 0 bottom
TP20  7.88,26.5 0 bottom
TP21  7.88,27.5 0 bottom
TP22  9.94,33.25 0 bottom
TP23  9.94,32.25 0 bottom
TP24  9.88,23.5 0 bottom
TP25  7.88,22.5 0 bottom
TP26  12.81,22.56 0 bottom
TP27  42.06,16.31 0 bottom
TP28  42.06,15.31 0 bottom
TP29  42.06,14.31 0 bottom
TP30  42.06,13.31 0 bottom
TP31  12.38,14.38 0 bottom
TP32  42.62,24.5 0 bottom
TP33  42.62,23.5 0 bottom
TP34  20.44,18.31 0 bottom
TP35  19.56,19.06 0 bottom
TP36  18.81,19.81 0 bottom
TP37  31.5,14.88 0 bottom
TP38  31.5,14.88 0 top
TP39  31.5,12.31 0 top
TP40  6.88,18.12 0 bottom
TP41  8.75,16.56 0 bottom
TP42  14.31,12.75 0 bottom
TP43  27.88,19.25 0 bottom
TP44  37.56,35.12 0 bottom
TP45  21.44,40.75 90 bottom
TP46  32.12,16.31 0 bottom
TP47  32.75,17.12 0 bottom
TP48  33.44,17.94 0 bottom
U1  30.38,45.12 270 top
U2  18.31,45.12 270 top
U3  25.94,36.5 90 top
U4  32.81,38.06 90 top
U5  19,36.88 270 top
U6  25,24.75 90 top
U7  9.94,22.5 270 top
U8  26.75,13 90 bottom
U9  37.75,31.25 270 top
U10  18,32.38 270 bottom
U$16  [SILK-SERVO-1]  14.38,0.31 0 top
U$24  [SILK-SERVO-4]  21.88,0.31 0 top
U$28  [SILK-SERVO-3]  19.38,0.31 0 top
U$31  [SILK-SERVO-2]  16.88,0.31 0 top
U$32  [SILK-SERVO-5]  25.88,0.31 0 top
U$33  [SILK-SERVO-6]  28.38,0.31 0 top
U$34  [SILK-SERVO-7]  30.88,0.31 0 top
U$35  [SILK-SERVO-8]  33.38,0.31 0 top
USB1  1.5,16.5 270 top

### Tracks (layer width: path | path; a pad name or v marks a point on that pad's centre or on a via)
3.3V  (via drill 0.3, 0.4, 0.5, 0.6)
  Top 0.203: C29.2 31.25,20.5 U6.1 29.62,21 v28.94,20.31 28.75,20.12 U6.64 | C15.1 30.81,32 30.56,31.75 28.19,31.75 27.75,31.31 U6.19 | U2.7 16.25,45.12 v16,44.88 16.25,44.62 U2.8 | U2.1 19.91,46.35 v20.25,46.69 | U4.13 30.88,38.81 30.44,39.25 v30.44,39.5 | U4.4 35.47,36.69 C6.1 | U6.32 21.25,30.44 20.69,30.44 v20.56,30.31 | U7.5 10.71,23.15 10.12,22.56 10.12,21.15 C22.1 | RA4.D1 35.06,15.56 v34.06,15.56 | U6.48 18.19,21 v18.06,20.88 | R3.2 21.21,15.03 C27.1 22.69,13.55 v22.69,12.94 | RA1.D2 RA1.C2 14.53,30.85 13.72,31.65 RA1.B1 RA1.A1 | RA1.A1 13.31,32.46 | 13.31,32.44 RA1.A1
  Top 0.305: v15.25,37.5 16.31,37.5 C9.2 18.05,37.52 U5.2
  Top 0.406: v31.69,33.12 30.85,32.29 C15.1 30.85,30.76 C17.1 | C22.1 v11.56,20.69 | CON7.3 6.19,25.5 7,26.31 v7,29.31 | v12.19,32.44 13.31,32.44 | C6.1 35.54,36.62 v36.5,36.62
  Bottom 0.203: TP43.1 27.9,19.27 C28.1
  Bottom 0.305: v28.94,20.31 28.09,20.31 C28.1 | C18.2 20.56,28.84 v20.56,30.31
  Bottom 0.406: 28.05,10.71 U8.5 27.98,12.12 27.94,12.12 28.5,12.69 v28.5,13.06 | C33.1 v29.12,10.31 v30.12,10.31 | JP4.1 41.62,18.25 v41.81,18.25 | CON4.2 v42.5,25.5 | C26.1 18.19,21 v18.06,20.88
  other vias: 31.5,12.31
  pour Route15: 0,0 0,50 50,50 50,0
3.3V-MAG  (via drill 0.5)
  Top 0.406: FB3.2 35.29,33.75 37.17,33.75 C36.1 | U9.5 38.42,32.2 37.56,33.06 37.56,33.36 C36.1 | TP44.1 37.56,34.01 C36.1
  other vias: 37.56,35.12
3.3VA  (via drill 0.4)
  Top 0.305: FB5.1 24.52,41.21 v24.06,40.75
  Top 0.406: FB4.1 21.12,41.06 TP45.1 | TP45.1 v24.06,40.75 | v41.88,22.62 v38.81,25.69 | FB2.1 33.6,44.27 33.62,44.25 v34.94,44.25 | FB1.2 21.44,41.96 TP45.1
  Bottom 0.203: C20.1 31.54,28.31
  Bottom 0.305: C20.1 32.25,27.6 32.25,27.5 33,26.75 FB7.2
  Bottom 0.406: 31.6,28.35 31.6,28.48 | 32.5,29.25 31.6,28.35 | 31.6,28.35 C20.1 | TP45.1 19.12,40.75 16.74,38.36 C39.1 16.74,33.36 U10.5 | 28.44,39.94 24.88,39.94 v24.06,40.75 | 32.5,29.25 34.12,29.25 37.69,25.69 v38.81,25.69 | FB6.2 v41.88,22.62 | 32.5,29.25 32.5,34.31 30.56,36.25 30.56,37.81 28.44,39.94 | 28.44,39.94 30,41.5 32.19,41.5 v34.94,44.25
  other vias: 21.44,40.75
ADC0  (via drill 0.3)
  Top 0.203: U6.11 37.19,26 39.5,23.69 v39.5,20.19
  Bottom 0.203: CON6.3 TP27.1 39.5,18.88 v39.5,20.19
ADC1  (via drill 0.3)
  Top 0.203: U6.10 36.94,25.5 38.88,23.56 v38.88,19.5
  Bottom 0.203: CON6.4 TP28.1 38.88,18.5 v38.88,19.5
ADC2  (via drill 0.3)
  Top 0.203: U6.9 36.69,25 38.25,23.44 v38.25,20.19
  Bottom 0.203: CON6.5 TP29.1 38.25,18.12 v38.25,20.19
ADC3  (via drill 0.3)
  Top 0.203: U6.8 36.44,24.5 37.62,23.31 v37.62,19.5
  Bottom 0.203: CON6.6 TP30.1 37.62,17.75 v37.62,19.5
BEC1
  Top 0.406: J4.2 J3.2 J2.2 J1.2
  Route2 0.406: J4.2 J3.2 J2.2 J1.2
  Route15 0.406: J4.2 J3.2 J2.2 J1.2
  Bottom 0.406: J1.2 J2.2 J3.2 J4.2 25.44,5.52 25.44,8.62 22.86,11.2 D2.1
  Bottom 0.61: 26.75,4 27,4 J4.2 | J1.2 34.54,4
  pour Bottom (no thermals): 25.25,4.31 26.69,4.31 26.69,3.5 26.5,3.31 25.25,3.31
BEC2
  Top 0.406: J5.2 J6.2 J7.2 J8.2
  Route2 0.406: J5.2 J6.2 J7.2 J8.2
  Route15 0.406: J8.2 J7.2 J6.2 J5.2
  Bottom 0.406: J8.2 J7.2 J6.2 J5.2 24.56,5.52 24.56,7.81 23.07,9.3 D2.2
  Bottom 0.61: J5.2 23.21,3.96
  pour Bottom (no thermals): 24.75,4.31 23.31,4.31 23.31,3.5 23.5,3.31 24.75,3.31
BEC_IN
  Bottom 0.406: D2.3 17.56,10.25 15.97,11.84 F2.1 TP42.1
CS  (via drill 0.3)
  Top 0.203: U6.33 12.62,28.5 TP16.1
  Bottom 0.203: CON2.6 6.56,37.5 8.62,35.44 8.62,32.5 TP16.1
  other vias: 9.94,31.19
GND  (via drill 0.3, 0.4, 0.5)
  Top 0.203: v27.25,21.69 28.25,20.69 U6.63 | C14.2 24.69,39.15 U3.18 24.69,37.75 24.88,37.56 24.88,35.31 24.69,35.12 U3.1 | U3.11 28.44,37.25 28.69,37.5 28.69,37.69 29.27,38.27 C12.2 | U6.18 28.25,29.81 v29.12,28.94 | U6.12 29.56,26.5 v29.25,26.19 | U2.16 20.73,45.62 C3.2 | U2.13 19.31,43.06 19.06,42.81 v18.56,42.81 | U2.12 18.81,43.06 v18.56,42.81 | U2.5 16.46,46.35 v16.44,46.38 | C5.2 32.69,33.6 C4.2 32.19,34.12 | U4.11 32.56,40.25 v32.69,40.38 | U7.3 8.88,21.81 9.12,21.81 9.29,21.65 C22.2 | C24.2 35.29,20.01 Q1.2 35.04,21.02 33.34,22.73 Q1.4 | LED4.2 v48.44,17.25 | LED2.2 47.38,27.57 47.88,28.07 v47.88,29 | LED1.2 v48.44,32.81 | LED3.2 47.88,21.89 v47.88,21 | R4.2 29.06,16.65 v29.06,15.56 | U2.10 17.81,43.06 18.06,42.81 v18.56,42.81 | U4.9 33.94,39.44 34.12,39.62 v34.12,40.31
  Top 0.305: 31.25,18.5 C29.1 31.4,18.69 v32.38,18.69 | C15.2 v33.31,32 | CON8.1 16.75,19 17.19,19.44 v17.19,20.56 | v15.25,36.25 16.31,36.25 C9.1 16.96,36.88 U5.7 | C7.2 v20.69,39.69 | v34.19,32.56 33.62,33.12 C5.2 | USB1.GND 8.05,15.2 v8.12,15.12
  Top 0.406: C11.2 22.66,38.38 v21.62,38.38 | C14.2 25.29,40.71 v25.19,40.81 | J8.3 J5.3 | J4.3 J1.3 | v3.5,35.25 CON5.1 | C17.2 v34.31,30.5 | C2.2 22.31,46 21.1,46 C3.2 21.31,46.21 v21.31,46.81 | U9.2 35.12,31.25 v35.06,31.31 | C12.2 28.85,38.27 v28.12,39 | C6.2 v35.5,38.88 | 40.5,31.88 C35.2 v40.5,34.06 | C34.2 v40.12,28.75 | C23.2 v36.81,20.25 | v35.88,19.56 C24.2 | CON7.1 v5.19,28.5 | C22.2 v8.31,20.69 | v31.19,42.56 31.19,41.46 C8.2 | v28.62,47.88 C1.2 U1.3 U1.4 | C13.2 27.88,42.38 v27.06,43.19 | v39.31,35.12 39.31,33.86 C36.2
  Bottom 0.305: C19.2 33.56,25.31 34.25,26 v34.25,26.81 34.25,27.5 33.5,28.25 C20.2 | C28.2 27.25,21.15 v27.25,21.69 | C16.1 21.73,26.12 v21,26.12
  Bottom 0.406: v21,26.12 C18.1 | U8.2 24.25,13 v24,12.75 24,11.56 25.25,10.31 C33.2 | J8.3 J5.3 | J4.3 J1.3 | CON2.1 2.19,32.5 v2,32.69 | C21.2 v42.56,21.5 | 42.56,20.44 C21.2 | C30.2 19.16,16.77 v19.62,16.31 | C38.2 v15.12,34.06 | U10.2 20.06,32.38 20.38,32.69 20.38,33.81 v19.94,34.25 19.49,34.25 18.9,34.84 18.74,34.84 C39.2 | CON3.1 5.19,21.88 v5.56,21.5 | CON9.4 5.19,18.06 v5.62,18.5 | CON4.1 44.31,27 v44.31,27.56 | CON6.1 44.75,18.38 44.12,18.38 43.56,18.94 43.56,19.81 42.91,20.46 C21.2 | C26.2 21.71,21.29 v21.06,21.94 21.91,22.79 C25.2 | CON1.1 45.94,36.69 v46.69,37.44 | v17.94,30.94 17.94,30.75 17.06,29.88 17.06,29.82 C37.2
  Bottom 0.61: C32.2 29.5,12 v30.12,11.38 | C31.2 29,15.62 v29.06,15.56
  Bottom 1.016: J5.3 23,1.44
  pour Route2: 0,0 0,50 50,50 50,0
GPS_TX  (via drill 0.3)
  Top 0.203: v22.25,17.69 U6.51
  Bottom 0.203: v22.25,17.69 22.19,17.62 19.94,17.62 17.69,19.88 9.88,19.88 6.88,16.88 | 6.88,16.88 6.88,16.12 6.25,15.5 CON9.2 | 6.88,16.88 TP40.1
GPX_RX  (via drill 0.3)
  Top 0.203: U6.52 22.75,18.06 v23.25,17.56
  Bottom 0.203: 7.44,16.44 7.44,16.56 10.12,19.25 17.5,19.25 19.69,17.06 22.75,17.06 v23.25,17.56 | 7.44,16.44 7.44,15.88 6.06,14.5 CON9.1 | TP41.1 7.56,16.56 7.44,16.44
MAG_DRDY  (via drill 0.3)
  Top 0.203: TP8.1 29.88,36.12 30.25,36.5 30.25,37.19 30.88,37.81 U4.15 | v23.5,29.06 23.25,29.31 U6.28
  Bottom 0.203: TP8.1 25.44,36.12 23.5,34.19 v23.5,29.06
  other vias: 29.69,36.12
MISO  (via drill 0.3)
  Top 0.203: U6.35 11.62,27.5 TP14.1
  Bottom 0.203: CON2.4 6.38,35.5 7.38,34.5 7.38,31.75 TP14.1
  other vias: 9.94,29.19
MOSI  (via drill 0.3)
  Top 0.203: U6.36 11.12,27 TP13.1
  Bottom 0.203: CON2.3 6.25,34.5 6.75,34 6.75,31.38 TP13.1
  other vias: 9.94,28.19
MPU_CS  (via drill 0.3)
  Top 0.203: U6.20 TP3.1 28.75,33.81 28.75,35.5 28.5,35.75 U3.8
  other vias: 27.25,32.31
MPU_INT  (via drill 0.3)
  Top 0.203: TP1.1 25.25,32.56 U6.24 | v26.06,35.5 26.06,36.5 27.31,37.75 U3.12
  Bottom 0.203: TP1.1 v26.06,35.5
  other vias: 26.06,33.38
MPU_MISO  (via drill 0.3)
  Top 0.203: TP2.1 26.25,32.31 U6.22 | U3.9 28.69,36.25 29.38,35.56 v29.38,34.69
  Bottom 0.203: TP2.1 28.62,34.69 v29.38,34.69
  other vias: 27.31,33.38
MPU_MOSI  (via drill 0.3)
  Top 0.203: U6.23 v25.75,29.06 | TP4.1 23.94,33.94 U3.24
  Bottom 0.203: TP4.1 25.75,32.12 v25.75,29.06
  other vias: 24.38,33.5
MPU_SCK  (via drill 0.3)
  Top 0.203: U6.21 v26.75,28.25 | TP5.1 23.06,33.62 23.06,35.44 23.38,35.75 U3.23
  Bottom 0.203: v26.75,28.25 25.69,28.25 24.25,29.69 TP5.1
  other vias: 24.25,32.44
N$1  (via drill 0.4)
  Top 0.203: U6.13 29.5,27 v29.25,27.25
  Bottom 0.305: C19.1 31.6,26.55 FB7.1 30.9,27.25 v29.25,27.25
N$2
  Top 0.203: U6.6 31.56,23.5 31.75,23.69 34.33,23.69 Q1.3 36.67,22.73 C23.1
N$3
  Top 0.203: U6.5 31.62,23 31.81,22.81 31.81,20.75 32,20.56 32.62,20.56 Q1.1 33.54,20.57 C24.1
N$4
  Bottom 0.406: D1.1 20.36,15.47 C30.1 17.46,15.47 16.56,16.38 F1.2
N$5
  Bottom 0.406: U8.4 29.2,13.95 C32.1
N$6  (via drill 0.3)
  Top 0.203: U6.25 24.75,28.31 v25.12,27.94 | U7.1 9.53,23.15 TP24.1
  Bottom 0.203: v25.12,27.94 25.12,26.62 23.38,24.88 11.25,24.88 TP24.1
  other vias: 9.88,23.5
N$7
  Top 0.406: U9.4 40.2,30.3 C35.1
N$8
  Top 0.203: USB1.D+ 6.79,16.5 R1.1
N$9
  Top 0.203: USB1.D- 6.75,17.15 R2.1
N$10
  Top 0.203: U6.44 15.25,23 12.25,20 12.25,19.88 11.81,19.44 11.31,19.44 10.88,19 10.88,18.62 9.69,17.44 8.56,17.44 8.5,17.5 R2.2
N$11
  Top 0.203: R1.2 9.25,16.19 15.56,22.5 U6.45
N$12
  Top 0.2: 47.29,9.41 arc9 47.59,9.56 48.35,8.95 48.86,9.47 48.25,10.22 arc19 48.51,10.85 49.48,10.95 49.48,11.68 48.51,11.78 arc19 48.25,12.4 48.86,13.16 48.35,13.68 47.59,13.06 arc19 46.96,13.32 46.87,14.29 46.13,14.29 46.04,13.32 arc19 45.41,13.06 44.65,13.68 44.14,13.16 44.75,12.4 arc19 44.49,11.78 43.52,11.68 43.52,10.95 44.49,10.85 arc19 44.75,10.22 44.14,9.47 44.65,8.95 45.41,9.56 arc9 45.71,9.41 46.14,10.45 arc-68 45.56,11.31 arc-248 46.86,10.45 47.29,9.41
  pour Top: 44.62,13.69 45.38,13.06 46.06,13.31 46.12,14.31 46.88,14.31 46.94,13.31 47.56,13.06 48.38,13.69 48.88,13.19 48.25,12.38 48.56,11.81 49.44,11.69 49.44,10.94 48.5,10.81 48.25,10.19 48.81,9.5 48.38,8.94 47.56,9.56 47.31,9.38 46.88,10.38 47.38,10.88 47.5,11.56 47.12,12.12 46.44,12.31 45.81,12.12 45.62,11.75 45.44,11.31 45.75,10.69 46.12,10.44 45.69,9.44 45.44,9.56 44.69,9 44.19,9.44 44.75,10.19 44.5,10.88 43.5,10.94 43.56,11.69 44.5,11.81 44.75,12.38 44.12,13.19
N$13  (via drill 0.3)
  Top 0.203: U6.43 13.75,23.5 TP26.1 12.12,21.88 11.06,21.88 U7.4
  other vias: 12.81,22.56
N$14
  Bottom 0.2: 38.21,2.03 arc-9 37.91,2.19 37.15,1.57 36.64,2.09 37.25,2.85 arc-19 36.99,3.47 36.02,3.57 36.02,4.3 36.99,4.4 arc-19 37.25,5.03 36.64,5.78 37.15,6.3 37.91,5.69 arc-19 38.54,5.95 38.63,6.92 39.37,6.92 39.46,5.95 arc-19 40.09,5.69 40.85,6.3 41.36,5.78 40.75,5.03 arc-19 41.01,4.4 41.98,4.3 41.98,3.57 41.01,3.47 arc-19 40.75,2.85 41.36,2.09 40.85,1.57 40.09,2.19 arc-9 39.79,2.03 39.36,3.07 arc68 39.94,3.94 arc248 38.64,3.07 38.21,2.03
  pour Bottom: 40.88,6.31 40.12,5.69 39.44,5.94 39.38,6.94 38.62,6.94 38.56,5.94 37.94,5.69 37.19,6.25 36.75,5.81 37.31,5.06 37,4.38 36.06,4.31 36.06,3.56 37,3.44 37.25,2.81 36.69,2.12 37.12,1.56 37.94,2.19 38.19,2.06 38.56,3 38.12,3.44 38,4.19 38.44,4.81 39.12,5 39.69,4.75 39.88,4.31 40.06,3.94 39.75,3.31 39.38,3.06 39.81,2.06 40.06,2.19 40.81,1.62 41.38,2.12 40.81,2.88 41,3.5 42,3.56 41.94,4.31 41,4.44 40.75,5 41.38,5.81
N$15
  Top 0.203: 34.12,38.81 U4.8 34.69,38.81 34.88,39 34.88,40.79 C10.1
N$16
  Top 0.15: U4.12 32.06,42.12 32.59,42.65
  Top 0.203: 32.06,39.88 U4.12 | 32.59,42.65 C10.2
N$18
  Top 0.203: U3.13 27.19,39.15 C14.1 | C14.1 27.23,39.75 C13.1 | C14.1 26.59,41.76 FB5.2
N$20
  Top 0.203: U4.10 33.06,39.88 33.31,40.12 33.31,41.04 C8.1
N$21
  Bottom 0.406: CON6.2 44.06,17.31 42.31,19.06 42.31,19.19 | JP4.2 41.62,19.88 42.31,19.19 | 42.31,19.19 42.34,19.16 C21.1
N$23
  Top 0.203: 20.73,44.62 C3.1 20.52,44.83 | 20.52,44.83 20.23,45.12 U2.15 19.5,45.12 | U2.14 20.31,44.62 20.52,44.83
  Top 0.406: C3.1 22.11,44.48 C2.1 22.29,44.25 FB1.1
N$24
  Top 0.203: RA4.D2 36.69,15.56 43.38,15.56 45.06,17.25 LED4.1
N$26
  Top 0.203: RA4.C2 36.7,16.38 43.25,16.38 45.67,18.8 LED3.1
N$29
  Bottom 0.406: JP4.3 | FB6.1 39.09,22.41 JP4.3
N$30
  Top 0.203: RA4.B2 36.71,17.19 | 36.7,17.12 RA4.B2 | LED2.1 44.12,26.07 44.12,21.06 43.62,20.56 43.62,18.5 42.27,17.15 RA4.B2
N$31
  Top 0.203: C11.1 22.84,37.25 U3.20
N$32
  Top 0.203: U3.10 29.21,36.75 C12.1
N$33
  Top 0.203: LED1.1 45.12,32.81 43.44,31.12 43.44,21.25 40.14,17.95 RA4.A2
N$34
  Top 0.203: J2.1 30.5,8 29,8 27.4,9.6 RA2.B2
N$35
  Top 0.203: J3.1 26.6,9.4 RA2.C2
N$36
  Top 0.203: J4.1 27,7.75 25.75,9 25.75,9.9 RA2.D2
N$37
  Top 0.203: J1.1 32.5,8.5 29.25,8.5 28.2,9.55 RA2.A2
N$38
  Top 0.203: J6.1 23.4,9.4 RA3.B2
N$39
  Top 0.203: J7.1 19.5,8 21,8 22.6,9.6 RA3.C2
N$40
  Top 0.203: J8.1 17.5,8.5 20.5,8.5 21.8,9.8 RA3.D2
N$41
  Top 0.203: J5.1 23,7.75 24.25,9 24.25,9.9 RA3.A2
N$44
  Top 0.203: U2.9 17.23,43.81 16.19,43.81 15.81,43.44 JP1.2
N$46  (via drill 0.3, 0.6)
  Top 0.203: U6.60 26.75,17.94 v27.56,17.12 | R4.1 31.5,16.09 TP37.1
  Bottom 0.203: TP37.1 29.25,17.12 v27.56,17.12
  other vias: 31.5,14.88
N$51
  Bottom 0.305: U10.4 16.4,31.73 C38.1
N$54
  Top 0.203: FB3.1 33.67,35.35 C5.1 C4.1 32.56,35.77 U4.2
N$58
  Top 0.305: U5.3 18.41,39.34 C7.1
  Top 0.406: FB4.2 18.41,40.92 C7.1
N$60
  cutout Route15: 31.06,39.81 34.56,39.81 34.56,36.31 31.06,36.31
N$61
  cutout Route2: 31.12,36.38 31.12,39.75 34.5,39.75 34.5,36.38
N$64
  Top 0.406: C1.1 31.02,46.27 U1.2 U1.1 33.56,46.23 FB2.2
NRST  (via drill 0.3)
  Top 0.203: v25.56,23.56 26,24 U6.7 | TP36.1 18.81,19.52 CON8.2 17,17.71 17,16.94 18.38,15.56 19.88,15.56 20.64,16.33 R3.1 21.21,16.33 C27.2
  Bottom 0.203: v25.56,23.56 21.81,19.81 TP36.1
  other vias: 18.81,19.81
PA15  (via drill 0.3)
  Top 0.203: U6.40 16.5,25 v15.62,24.12 | v15.12,20.5 15.12,20.44 12.62,17.94 12.62,17.06 18.31,11.38 21.62,11.38 RA3.D1
  Bottom 0.203: v15.62,24.12 15.12,23.62 v15.12,20.5
PB0  (via drill 0.3)
  Top 0.203: U6.26 24.25,28.19 v24.12,28.06
  Bottom 0.203: v24.12,28.06 24.12,26.5 23.06,25.44 9.19,25.44 8.12,26.5 TP20.1 CON3.5
PB1  (via drill 0.3)
  Top 0.203: U6.27 23.75,32.06 22.38,33.44 v22.38,33.81 22.38,36.06 v21.5,36.94 | JP1.1 15.87,42.06 v17.25,42.06
  Bottom 0.203: v22.38,33.81 20.5,31.94 20.5,31.25 19.94,30.69 19.94,28.81 18.62,27.5 TP21.1 CON3.6 | v21.5,36.94 22.31,37.75 22.31,41.38 21.62,42.06 v17.25,42.06
PB3  (via drill 0.3)
  Top 0.203: U6.41 17,24.5 v16.62,24.12 | v16.19,20.56 15.62,20 15.62,14.81 18.62,11.81 20.81,11.81 21.44,12.44 22.31,12.44 22.56,12.19 22.56,11.59 RA3.C1
  Bottom 0.203: v16.62,24.12 16.19,23.69 v16.19,20.56
PB4
  Top 0.203: U6.50 21.75,18.12 21.56,17.94 21.56,17.38 23.31,15.62 23.31,11.64 RA3.B1 23.38,11.57
PB5
  Top 0.203: U6.55 24.25,13.5 24.69,13.06 24.69,12.04 RA3.A1
PB6
  Top 0.203: 25.75,11.6 RA2.D1 25.81,11.56 25.81,12.56 24.75,13.62 U6.56
PB7
  Top 0.203: U6.57 25.25,13.88 26.56,12.56 26.56,11.59 RA2.C1
PB8
  Top 0.203: U6.58 25.75,14.12 27.38,12.5 27.38,11.57 RA2.B1
PB9
  Top 0.203: U6.59 26.25,14.31 28.19,12.38 28.19,11.56 RA2.A1
PC6  (via drill 0.3)
  Top 0.203: U6.37 8.88,26.5 TP19.1
  Bottom 0.203: TP19.1 CON3.4
  other vias: 7.88,25.5
PC7  (via drill 0.3)
  Top 0.203: U6.38 9.38,26 TP18.1
  Bottom 0.203: TP18.1 CON3.3
  other vias: 7.88,24.5
PC8  (via drill 0.3)
  Top 0.203: U6.39 9.88,25.5 TP17.1
  Bottom 0.203: TP17.1 CON3.2
  other vias: 7.88,23.5
PC13  (via drill 0.3)
  Top 0.203: U6.2 29.12,21.5 v28.88,21.25 | RA4.C1 35.04,16.31 TP46.1
  Bottom 0.203: TP46.1 30.19,18.25 30.19,20.06 29,21.25 v28.88,21.25
  other vias: 32.12,16.31
PC14  (via drill 0.3)
  Top 0.203: RA4.B1 35.05,17.12 TP47.1 | v28.88,22.31 29.19,22 U6.3
  Bottom 0.203: TP47.1 30.88,19 30.88,20.31 v28.88,22.31
  other vias: 32.75,17.12
PC15  (via drill 0.3)
  Top 0.203: RA4.A1 35.06,17.94 TP48.1 | v28.88,23.31 29.69,22.5 U6.4
  Bottom 0.203: TP48.1 33.44,18.75 v28.88,23.31
  other vias: 33.44,17.94
RC_RX  (via drill 0.3)
  Top 0.203: U7.2 TP25.1 5.88,24.5 CON7.4
  other vias: 7.88,22.5
SCK  (via drill 0.3)
  Top 0.203: U6.34 12.12,28 TP15.1
  Bottom 0.203: CON2.5 6.44,36.5 8,34.94 8,32.12 TP15.1
  other vias: 9.94,30.19
SCL  (via drill 0.3)
  Top 0.203: U4.1 32.06,36.19 31.94,36.06 31.56,36.06 31.06,35.56 v31.06,34.75 | 14.94,32.46 RA1.A2 16.7,32.45 17.28,33.03 | v27.5,29 27.5,28.12 26.62,27.25 24,27.25 22.75,28.5 U6.29 22.75,32.19 21.5,33.44 TP7.1 21.06,36.06 19.31,36.06 19,35.75 U5.5 19,34.75 17.28,33.03 | v17.81,47.25 U2.4 | U1.8 32.19,43.99 32.19,43.62 32.06,43.5 v32.06,42.94 | JP2.2 17.28,33.66 17.28,33.03
  Bottom 0.203: TP7.1 22.88,37 22.88,42.19 22.84,42.22 | v27.5,29 27.5,31.62 30.62,34.75 v31.06,34.75 | 22.84,42.22 v17.81,47.25 | v32.06,42.94 31.06,43.94 24.56,43.94 22.84,42.22
  other vias: 21.5,35.62
SCL-EXT  (via drill 0.3)
  Top 0.203: U6.61 27.25,19.88 23.75,23.38 23.75,25.19 19.94,29 13.12,29 v12.38,29.75 | TP22.1 12.31,30.88 13.3,30.88 RA1.C1 | CON5.3 TP22.1 | JP2.1 15.31,33.25 TP22.1
  Bottom 0.203: v12.38,29.75 12.38,30.81 TP22.1
  other vias: 9.94,33.25
SDA  (via drill 0.3)
  Top 0.203: 14.96,31.69 RA1.B2 15.44,31.65 | v28.25,28.12 26.94,26.81 23.69,26.81 22.25,28.25 U6.30 22.25,31.81 20.88,33.19 | 20.88,33.19 v20.88,34.38 20.88,34.85 U5.6 | 15.44,31.65 19.34,31.65 20.88,33.19 | v15.81,30.38 15.81,31.27 15.44,31.65 | U4.16 31,37.31 30.69,37 30.69,35.94 30.38,35.62 30.38,33.56 v29.19,32.38 | U2.6 15.69,45.62 14.44,44.38 v14.44,35.19 | U1.7 30.94,43.99 30.94,43.25 30.19,42.5 v29.62,42.5
  Bottom 0.203: v29.19,32.38 28.25,31.44 v28.25,28.12 | v14.44,35.19 14.44,33.88 13.94,33.38 | 13.94,33.38 TP6.1 15.19,30.38 v15.81,30.38 | JP3.2 12.25,33.38 13.94,33.38 | v29.62,42.5 29.25,42.12 24.38,42.12 23.38,41.12 23.38,36.5 21.25,34.38 v20.88,34.38
SDA-EXT  (via drill 0.3)
  Top 0.203: U6.62 27.75,20.19 24.31,23.62 24.31,25.38 20.25,29.44 13.94,29.44 RA1.D1 12.95,30.05 12.62,30.38 11.81,30.38 TP23.1 CON5.4
  Bottom 0.203: JP3.1 11.37,34.01 11.19,34.19 9.56,34.19 9.19,33.81 9.19,33 TP23.1
  other vias: 9.94,32.25
SWDCLK  (via drill 0.3)
  Top 0.202: U6.49 21.12,19 TP34.1 CON8.4 | CON8.4
  other vias: 20.44,18.31
SWDIO  (via drill 0.3)
  Top 0.203: CON8.3 19.56,18.86 TP35.1 20.5,20 20.5,21.56 20.06,22 U6.46
  other vias: 19.56,19.06
TELEM_CTS  (via drill 0.3)
  Top 0.203: TP12.1 41.25,26.5 35.62,26.5 34.62,27.5 U6.14
  Bottom 0.203: TP12.1 43.69,28.94 43.69,31.12 44.25,31.69 CON1.6
  other vias: 41.88,27.12
TELEM_RTS  (via drill 0.3)
  Top 0.203: TP11.1 40.38,27 35.94,27 34.94,28 U6.15
  Bottom 0.203: CON1.5 44.06,32.69 43.25,31.88 43.25,29.88 TP11.1
  other vias: 41.88,28.5
TELEM_RX  (via drill 0.3)
  Top 0.203: U6.17 29.12,30.5 30.44,29.19 35,29.19 v35.31,29.5
  Bottom 0.203: v35.31,29.5 TP10.1 | TP10.1 42.62,30.25 42.62,32.25 44.06,33.69 CON1.4 | TP10.1 41.06,29.5
TELEM_TX  (via drill 0.3)
  Top 0.203: U6.16 35.31,28.5 36.31,27.5 39.88,27.5 41.88,29.5 TP9.1
  Bottom 0.203: TP9.1 41.88,32.56 44,34.69 CON1.3
  other vias: 41.88,31.69
USART5_RX  (via drill 0.3)
  Top 0.203: U6.54 23.75,19.81 v24.38,20.44
  Bottom 0.203: v24.38,20.44 27.88,23.94 42.19,23.94 TP33.1 CON4.4
USART5_TX  (via drill 0.3)
  Top 0.203: U6.53 23.25,20.19 v23.5,20.44
  Bottom 0.203: v23.5,20.44 27.56,24.5 TP32.1 42.69,24.5 CON4.3
VCAP@1  (via drill 0.4)
  Top 0.203: U6.31 21.75,31.25 v21.25,31.75
  Bottom 0.203: v21.25,31.75 21.25,29.6 C16.2
VCAP@2  (via drill 0.4)
  Top 0.203: U6.47 18.38,21.5 v18.06,21.81
  Bottom 0.406: C25.1 19.19,22.94 v18.06,21.81
VCC  (via drill 0.4, 0.5)
  Top 0.406: v3.5,34.25 CON5.2 v13.75,34.25 | U9.1 37.3,32.2 37.62,31.88 37.62,31.25 | U9.3 37.3,30.3 37.62,30.62 37.62,31.25 | v38.94,31.25 37.62,31.25 | U9.3 | U9.3 36.44,30.31 | CON7.2 v3.5,26.5 | C34.1 36.99,29.76 U9.3
  Route15 0.406: v18,32.38 15.62,32.38 v13.75,34.25
  Route15 0.61: 4.88,16.5 v1.62,16.5
  Route15 0.813: v3.5,34.25 v3.5,33.31 v3.5,26.5 3.5,17.88 4.88,16.5 9.5,16.5 17.12,8.88 19.56,8.88 | 19.56,8.88 21.31,8.88 | 21.31,8.88 33.88,8.88 38.25,13.25 42.06,13.25 46.69,17.88 v46.69,35.69 | 20.44,9.75 v20.44,13.62 | 19.56,8.88 20.44,9.75 | 21.31,8.88 20.44,9.75
  Bottom 0.305: U10.1 18.39,33.33 18,32.94 v18,32.38 18,31.81 18.39,31.43 18.75,31.43 | U10.3 18.75,31.43 | CON9.3 v1.62,16.5 | 18.84,31.34 18.75,31.43
  Bottom 0.406: U8.1 25.5,12 26.25,12 26.75,12.5 26.75,14 25.5,14 U8.3 | U8.3 25.44,13.94 22.62,13.94 21.65,12.96 D1.3 | v46.69,35.69 CON1.2 43.38,35.69 v38.94,31.25 | CON2.2 3.69,33.5 v3.5,33.31 | C37.1 18.89,31.01 U10.3 | C31.1 25.45,15.28 U8.3 | F2.2 18.88,12.75 19.19,13.06
  Bottom 0.61: D1.3 21.52,13.06 20.44,13.06 | v20.44,13.62 20.44,13.06 | 20.44,13.06 v20.44,12.5 | 19.19,13.06 20.44,13.06
VUSB  (via drill 0.3, 0.5)
  Top 0.203: v21,24 U6.42 | v16.88,21.75 15.5,21.75 12.19,18.44 v12.19,16.38
  Top 0.305: USB1.VBUS 3.17,17.8 2.38,17 2.38,14.81 v3.31,13.88
  Bottom 0.203: v16.88,21.75 19.12,24 v21,24
  Bottom 0.406: v3.31,13.88 3.62,13.56 11.56,13.56 TP31.1 13.66,15.66 F1.1 v12.19,16.38

### Text on the board
Bottom: designed by / angus peart / and / david carlson | dec. 2012
_tsilk: I2C | Error | RC Input | Warning | Status | SWD | Power | SBL | ~ | ~ | ~ | + | + | + | - | - | -
_bsilk: Telemetry | SPI Bus | Serial | Utility | 3.3VA | 3.3V | Analogs | GPS